# Altium project S7_CAS_lepo3002.PrjPcb (part 1 of 4)
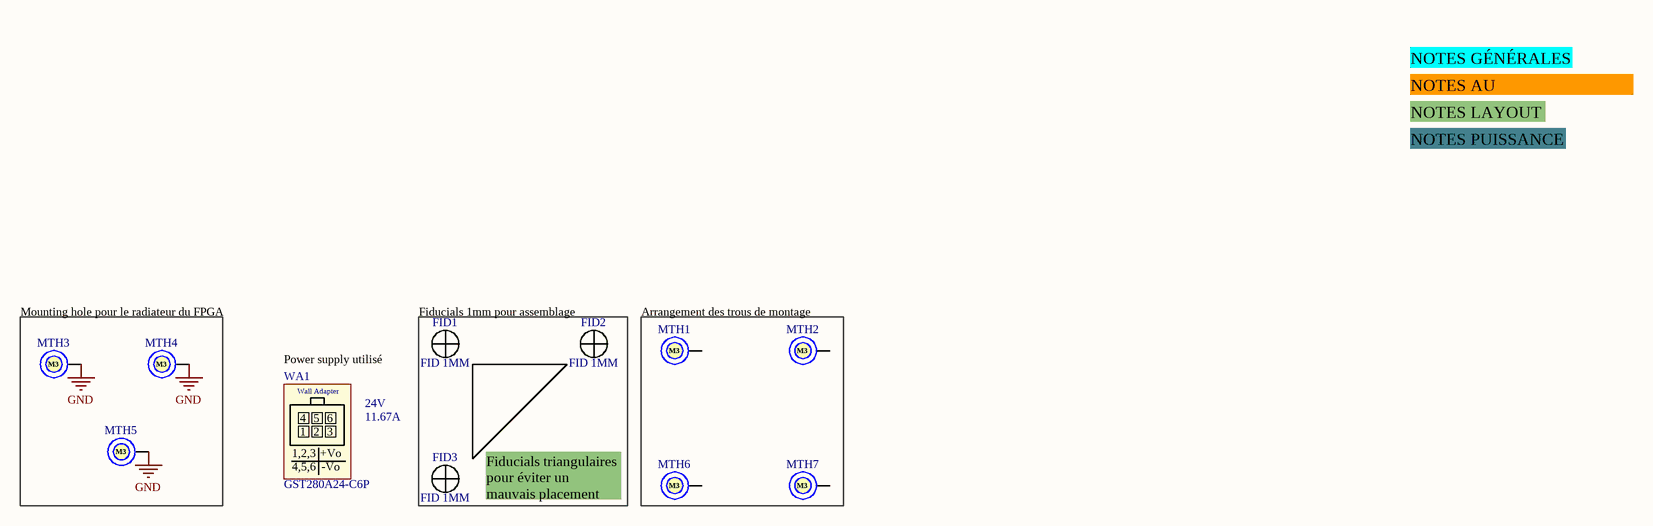
[diagram p0: PROB_S7CAS_Title.SchDoc]
Project_Date: 2023-02-02; Project_Designer1: Samuel Cloutier (clos2312); Project_Designer2: Olivier Lepage (lepo3002); Project_Global: S7_CAS_PROB; Project_Group: clos2312-lepo3002 P11; Project_Name: Pléiades; Project_Revision: 1.00
15 sheets, 468 parts. Net scope: flat (ports and power ports of the same name join across sheets).
Board file: PROB_S7CAS_PCB.PcbDoc
Sheets:
  PROB_S7CAS_Title.SchDoc
  PROB_S7CAS_Connectors.SchDoc
  PROB_S7CAS_ArbreAlimentation.SchDoc
  PROB_S7CAS_BilanPuissance.SchDoc
  PROB_S7CAS_FPGA_1.SchDoc
  PROB_S7CAS_FPGA_2.SchDoc
  PROB_S7CAS_FPGA_3.SchDoc
  PROB_S7CAS_INTERFACE.SchDoc
  PROB_S7CAS_Clock.SchDoc
  PROB_S7CAS_DDR.SchDoc
  PROB_S7CAS_PHY.SchDoc
  PROB_S7CAS_DAC.SchDoc
  PROB_S7CAS_ADC.SchDoc
  PROB_S7CAS_MOTDRIVER.SchDoc
  PROB_S7CAS_FLASH-JTAG.SchDoc

## Sheet PROB_S7CAS_Title.SchDoc
size Tabloid; SheetNumber: 1; SheetTotal: 15; Sheet_Name: Insert name in Document Parameters; Size: 11x17

### Parts
FID1  FID 1MM  [FID_CIRCLE_1MM]
FID2  FID 1MM  [FID_CIRCLE_1MM]
FID3  FID 1MM  [FID_CIRCLE_1MM]
MTH1  M3  [MTH_M3]  (no BOM)
MTH2  M3  [MTH_M3]  (no BOM)
MTH3  M3  [MTH_M3]  (no BOM)
MTH4  M3  [MTH_M3]  (no BOM)
MTH5  M3  [MTH_M3]  (no BOM)
MTH6  M3  [MTH_M3]  (no BOM)
MTH7  M3  [MTH_M3]  (no BOM)
WA1  GST280A24-C6P  value 24V  Current Rating: 11.67A  [Model Name]  (mechanical)

### Nets
GND: MTH3.1 MTH4.1 MTH5.1

Not connected (* = marked no-connect by the designer): FID1 1 2; FID2 1 2; FID3 1 2; MTH1 1; MTH2 1; MTH6 1; MTH7 1

### Notes on the sheet
- LÉGENDE NOTES
- NOTES GÉNÉRALES
- NOTES AU PROGRAMMEUR
- NOTES LAYOUT
- NOTES PUISSANCE
- Mounting hole pour le radiateur du FPGA
- Fiducials 1mm pour assemblage
- Arrangement des trous de montage
- Power supply utilisé
- Fiducials triangulaires pour éviter un mauvais placement
- Revision history
- Package size conversion
- Metric
- 1005
- 1608
- Imperial
- 0402
- 0603
- Revision
- 2012
- 3216
- 0805
- 1206
- 3225
- 6432
- 1210
- 2512
- Date :
- Project Title
- Global Project
- Size
- Group
- Date
- Sheet
- of
- Filename
- Designers
- (in symbol UND_GST280A24-C6P) Wall Adapter; 4; 5; 6; 1; 2; 3; 1,2,3; +Vo; 4,5,6; -Vo

### Library data of the parts
FID1-FID3 = FID_CIRCLE_1MM: FID - FIDUCIAL 1MM CIRCLE DOUBLE-SIDED - 1MM; GRAMS Lib Spec: 2.8; Magnetic Material: NO; Cryo: UNKNOWN; Value: *; Tolerance: *; Voltage Rating: *; Current Rating: *; Power Max: *; HelpURL: https://www.pcb-3d.com/wordpress/wp-content/uploads/ipc-sm-782a_amendment_1_and_2.pdf; CreatedBy/Date: Jonathan Bouchard 2018-07-23; VerifiedBy: Caroline Paulin - 25 juillet 2018; Temperature: *; Package: 1MM CIRCLE; Manufacturer #1: *; Manufacturer #2: *; Note: *; Assembly Type: NONE; Part Number #2: *; Part Number #1: *; Polarized: *; Supplier 1: *; Supplier Part Number 1: *
MTH1-MTH7 = MTH_M3: MTH - MOUNTING HOLE M3 PLATED - M3; GRAMS Lib Spec: 2.8; Magnetic Material: NO; Cryo: UNKNOWN; Value: *; Tolerance: *; Voltage Rating: *; Current Rating: *; Power Max: *; HelpURL: https://littlemachineshop.com/images/gallery/PDF/TapDrillSizes.pdf; CreatedBy/Date: Jonathan Bouchard 2018-07-23; VerifiedBy: Arnaud Samson 23-07-18; Temperature: *; Package: M3; Manufacturer #1: *; Manufacturer #2: *; Note: *; Assembly Type: NONE; Part Number #2: *; Part Number #1: *; Polarized: *; Supplier 1: *; Supplier Part Number 1: *
WA1 = UND_GST280A24-C6P: UND - AC/DC DESKTOP ADAPTER 24V 280W - MEC; Manufacturer #1: MEAN WELL USA Inc.; Tolerance: ±3%; Voltage Rating: 85~264VAC; GRAMS Lib Spec: 2.8; Magnetic Material: Unknown; Polarized: Yes; Power Max: 280W; HelpURL: https://www.meanwell.com/Upload/PDF/GST280A/GST280A-SPEC.PDF; CreatedBy/Date: Caroline Paulin - 5 avril 2019; VerifiedBy: Nicolas V. (2019-07-05); Temperature: -30°C to +70°C; Package: -; Manufacturer #2: *; Note: *; Assembly Type: -; Part Number #2: *; Part Number #1: GST280A24-C6P; Supplier 1: Digi-Key; Supplier Part Number 1: 1866-2122-ND; Cryo: UNKNOWN

## Sheet PROB_S7CAS_Connectors.SchDoc
size Tabloid; SheetNumber: 2; SheetTotal: 15; Sheet_Name: Connectors; Size: 11x17
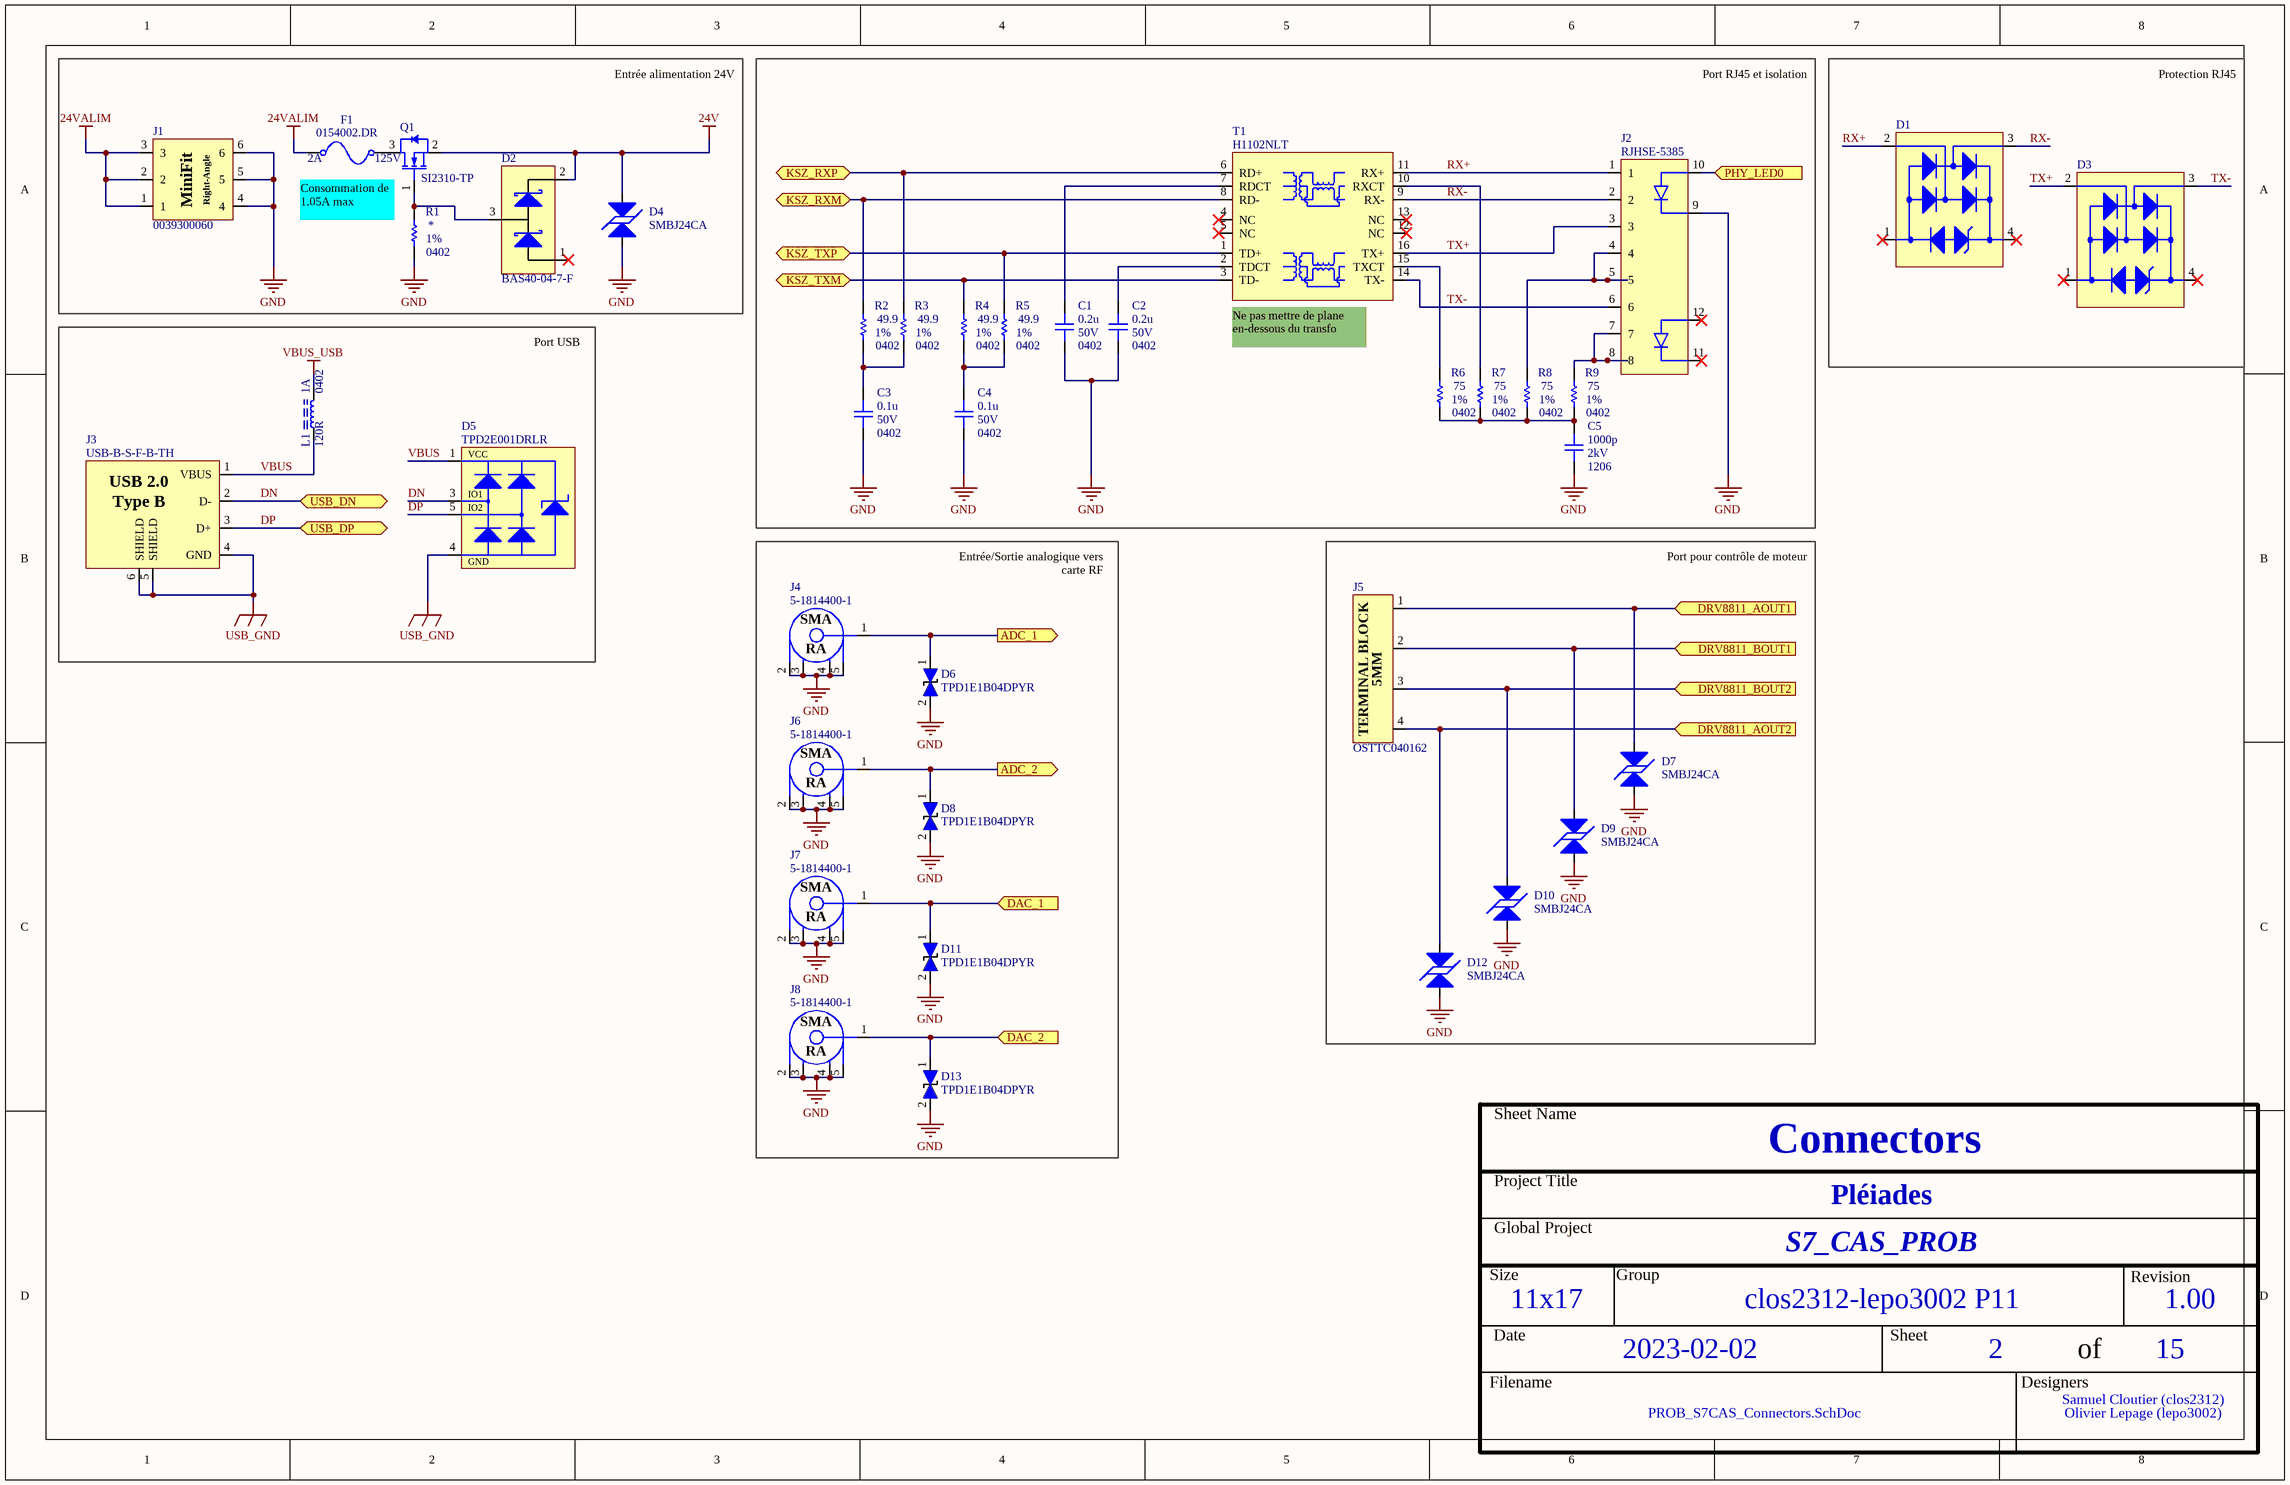
[diagram p1: PROB_S7CAS_Connectors.SchDoc]

### Parts
C1  value 0.2u  Voltage: 50V  Package: 0402  [CAP_0402]  (hidden comment: CAP - 0402)
C2  value 0.2u  Voltage: 50V  Package: 0402  [CAP_0402]  (hidden comment: CAP - 0402)
C3  value 0.1u  Voltage: 50V  Package: 0402  [CAP_0402]  (hidden comment: CAP - 0402)
C4  value 0.1u  Voltage: 50V  Package: 0402  [CAP_0402]  (hidden comment: CAP - 0402)
C5  value 1000p  Voltage: 2kV  Package: 1206  [CAP_0402]  (hidden comment: CAP - 0402)
D1  SR3.3.TCT  [TVS_SR3.3.TCT]  (value not drawn)
D2  BAS40-04-7-F  [DIO_SCHOTTKY_BAS40-04-7-F]
D3  SR3.3.TCT  [TVS_SR3.3.TCT]  (value not drawn)
D4  SMBJ24CA  [TVS_PWR_SMBJ36CA]
D5  TPD2E001DRLR  [TVS_USB_TPD2E001DRLR]
D6  TPD1E1B04DPYR  [TVS_DATA_TPD1E1B04DPYR]
D7  SMBJ24CA  [TVS_PWR_SMBJ36CA]
D8  TPD1E1B04DPYR  [TVS_DATA_TPD1E1B04DPYR]
D9  SMBJ24CA  [TVS_PWR_SMBJ36CA]
D10  SMBJ24CA  [TVS_PWR_SMBJ36CA]
D11  TPD1E1B04DPYR  [TVS_DATA_TPD1E1B04DPYR]
D12  SMBJ24CA  [TVS_PWR_SMBJ36CA]
D13  TPD1E1B04DPYR  [TVS_DATA_TPD1E1B04DPYR]
F1  0154002.DR  Voltage Rating: 125V  Current Rating: 2A  [FUS_0154XXX.DR]
J1  0039300060  [CON_MINIFIT_0039300060]
J2  RJHSE-5385  [CONN_ETHERNET_RJHSE-5385]
J3  USB-B-S-F-B-TH  [CON_USB_USB-B-S-F-B-TH]
J4  5-1814400-1  [CONN_SMA_5-1814400-1]
J5  OSTTC040162  [CONN_TERMINAL_OSTTA040161]
J6  5-1814400-1  [CONN_SMA_5-1814400-1]
J7  5-1814400-1  [CONN_SMA_5-1814400-1]
J8  5-1814400-1  [CONN_SMA_5-1814400-1]
L1  value 120R  Current: 1A  Package: 0402  [FER_0402]  (hidden comment: FER - 0402)
Q1  SI2310-TP  [TRX_NMOS_SI2310-TP]
R1  Package: 0402  Precision: 1%  [RES_0402]  (hidden comment: RES - 0402)
R2  value 49.9  Package: 0402  Precision: 1%  [RES_0402]  (hidden comment: RES - 0402)
R3  value 49.9  Package: 0402  Precision: 1%  [RES_0402]  (hidden comment: RES - 0402)
R4  value 49.9  Package: 0402  Precision: 1%  [RES_0402]  (hidden comment: RES - 0402)
R5  value 49.9  Package: 0402  Precision: 1%  [RES_0402]  (hidden comment: RES - 0402)
R6  value 75  Package: 0402  Precision: 1%  [RES_0402]  (hidden comment: RES - 0402)
R7  value 75  Package: 0402  Precision: 1%  [RES_0402]  (hidden comment: RES - 0402)
R8  value 75  Package: 0402  Precision: 1%  [RES_0402]  (hidden comment: RES - 0402)
R9  value 75  Package: 0402  Precision: 1%  [RES_0402]  (hidden comment: RES - 0402)
T1  H1102NLT  [TRANSFO_H1102NLT]

### Ports
ADC_1 (out), ADC_2 (out), DAC_1 (in), DAC_2 (in), DRV8811_AOUT1 (in), DRV8811_AOUT2 (in), DRV8811_BOUT1 (in), DRV8811_BOUT2 (in), KSZ_RXM (bidir), KSZ_RXP (bidir), KSZ_TXM (bidir), KSZ_TXP (bidir), PHY_LED0 (in), USB_DN (bidir), USB_DP (bidir)

### Nets
24V: D2.2(K) D4.1 Q1.2(S)
24VALIM: F1.1 J1.1 J1.2 J1.3
GND: C1.1 C2.1 C3.1 C4.1 C5.1 D4.2 D6.2(i/o) D7.2 D8.2(i/o) D9.2 D10.2 D11.2(i/o) D12.2 D13.2(i/o) J1.4 J1.5 J1.6 J2.9(LED1_K) J4.2 J4.3 J4.4 J4.5 J6.2 J6.3 J6.4 J6.5 J7.2 J7.3 J7.4 J7.5 J8.2 J8.3 J8.4 J8.5 R1.1
USB_GND: D5.4(GND) J3.4(GND) J3.5(SHIELD) J3.6(SHIELD)
VBUS_USB: L1.1
ADC_1: D6.1(i/o) J4.1 ; port ADC_1
ADC_2: D8.1(i/o) J6.1 ; port ADC_2
DAC_1: D11.1(i/o) J7.1 ; port DAC_1
DAC_2: D13.1(i/o) J8.1 ; port DAC_2
DN: D5.3(IO1) J3.2(D-) ; port USB_DN
DP: D5.5(IO2) J3.3(D+) ; port USB_DP
DRV8811_AOUT1: D7.1 J5.1 ; port DRV8811_AOUT1
DRV8811_AOUT2: D12.1 J5.4 ; port DRV8811_AOUT2
DRV8811_BOUT1: D9.1 J5.2 ; port DRV8811_BOUT1
DRV8811_BOUT2: D10.1 J5.3 ; port DRV8811_BOUT2
KSZ_RXM: R2.2 T1.8(RD-) ; port KSZ_RXM
KSZ_RXP: R3.2 T1.6(RD+) ; port KSZ_RXP
KSZ_TXM: R4.2 T1.3(TD-) ; port KSZ_TXM
KSZ_TXP: R5.2 T1.1(TD+) ; port KSZ_TXP
PHY_LED0: J2.10(LED1_A) ; port PHY_LED0
RX+: D1.2(VN) J2.1 T1.11(RX+)
RX-: D1.3 J2.2 T1.9(RX-)
TX+: D3.2(VN) J2.3 T1.16(TX+)
TX-: D3.3 J2.6 T1.14(TX-)
VBUS: D5.1(VCC) J3.1(VBUS) L1.2
NetC1_2: C1.2 T1.7(RDCT)
NetC2_2: C2.2 T1.2(TDCT)
NetC3_2: C3.2 R2.1 R3.1
NetC4_2: C4.2 R4.1 R5.1
NetC5_2: C5.2 R6.1 R7.1 R8.1 R9.1
NetD2_3: D2.3(AK) Q1.1(G) R1.2
NetF1_2: F1.2 Q1.3(D)
NetJ2_4: J2.4 J2.5 R8.2
NetJ2_7: J2.7 J2.8 R9.2
NetR6_2: R6.2 T1.15(TXCT)
NetR7_2: R7.2 T1.10(RXCT)

Not connected (* = marked no-connect by the designer): D1 1(I/O)* 4*; D2 1(A)*; D3 1(I/O)* 4*; D5 2(NC); J2 11(LED2_K)* 12(LED2_A)*; T1 4(NC)* 5(NC)* 12(NC)* 13(NC)*

### Notes on the sheet
- Entrée alimentation 24V
- Port RJ45 et isolation
- Protection RJ45
- (near Q1) Consommation de 1.05A max
- Port USB
- (near T1) Ne pas mettre de plane en-dessous du transfo
- Entrée/Sortie analogique vers carte RF
- Port pour contrôle de moteur
- Sheet Name
- Project Title
- Global Project
- Size
- Group
- Revision
- Date
- Sheet
- of
- Filename
- Designers
- (in symbol CON_MINIFIT_0039300060) MiniFit; Right-Angle
- (in symbol CON_USB_USB-B-S-F-B-TH) USB 2.0; Type B
- (in symbol CONN_SMA_5-1814400-1) SMA; RA
- (in symbol CONN_TERMINAL_OSTTC040162) TERMINAL BLOCK; 5MM

### Library data of the parts
C1-C5 = CAP - 0402: Precision: 10%; Current: *; CreatedBy: Jonathan Bouchard; Power: *
D1 D3 = TVS_SR3.3.TCT: TVS - DIODE ARRAY 3.3V 150W - SOT143-4; Mfg: Semtech; Voltage: VBR=3.3V; Current: *; Mfg Part Number: SR3.3.TCT; HelpURL: http://www.semtech.com/images/datasheet/sr3.3.pdf; CreatedBy: Jonathan Bouchard; Temperature: -55°C to 125°C; Power: 150W; Package: SOT143-4; Precision: *; Value: *; Supplier 1: Digikey; Supplier Part Number 1: SR3.3DKR-ND
D2 = DIO_SCHOTTKY_BAS40-04-7-F: DIO - Schottky Array 1 Pair Series Connection - SOT-23-3; Manufacturer #1: Diodes Incorporated; Voltage Rating: 40V dc reverse; Current Rating: 200mA; GRAMS Lib Spec: 2.8; Magnetic Material: Unknown; Polarized: Yes; Value: -; Tolerance: -; Power Max: -; HelpURL: https://www.diodes.com/assets/Datasheets/ds11006.pdf; CreatedBy/Date: Danae D-F 15 août 2019; VerifiedBy: C.Paulin - 16/08/2019; Temperature: -55°C ~ 125°C; Package: SOT-23-3; Manufacturer #2: -; Assembly Type: SMD; Part Number #2: -; Part Number #1: BAS40-04-7-F; Supplier 1: Digi-Key; Supplier Part Number 1: BAS40-04FDITR-ND; Cryo: UNKNOWN
D4 D7 D9 D10 D12 = TVS_PWR_SMBJ24CA: TVS - 24V 26.7V 600W - DO214AA; Manufacturer #1: Littelfuse Inc.; Value: Vbr = 26.7V -  Clamp = 38.9V; Voltage Rating: 24V Standoff; Current Rating: 15.5A; GRAMS Lib Spec: 2.8; Magnetic Material: UNKNOWN; Polarized: NO; Tolerance: *; Power Max: 600W; HelpURL: http://www.littelfuse.com/~/media/electronics/datasheets/tvs_diodes/littelfuse_tvs_diode_smbj_datasheet.pdf.pdf; CreatedBy/Date: Arnaud Samson - 06/07/18; VerifiedBy: Jonathan Bouchard - 2018-07-13; Temperature: -65°C ~ 150°C (TJ); Package: DO214AA; Manufacturer #2: *; Note: *; Assembly Type: SMD; Part Number #2: *; Part Number #1: SMBJ24CA; Supplier 1: Digi-Key; Supplier Part Number 1: SMBJ24CALFCT-ND; Cryo: UNKNOWN
D5 = TVS_USB_TPD2E001DRLR: TVS - USB TVS DIODE 5.5V - SOT-553; Manufacturer #1: Texas Instruments; Value: 11V Breakdown; Voltage Rating: 5.5V (Max); GRAMS Lib Spec: 2.8; Magnetic Material: YES; Cryo: UNKNOWN; Tolerance: *; Current Rating: *; Power Max: *; HelpURL: http://www.ti.com/lit/ds/symlink/tpd2e001.pdf; CreatedBy/Date: Jonathan Bouchard 2018-07-10; VerifiedBy: Arnaud Samson 16-07-18; Temperature: -40°C ~ 85°C (TA); Package: SOT-553; Manufacturer #2: *; Note: *; Assembly Type: SMD; Part Number #2: *; Part Number #1: TPD2E001DRLR; Polarized: YES; Supplier 1: Digi-Key; Supplier Part Number 1: 296-21883-1-ND
D6 D8 D11 D13 = TVS_DATA_TPD1E1B04DPYR: TVS - TVS DIODE 3.6V 8.5V - 0402; Manufacturer #1: Texas Instruments; Current Rating: 6.3Apeak; Power Max: 50Wpeak; GRAMS Lib Spec: 2.8; Magnetic Material: Unknown; Polarized: No; Value: *; Tolerance: *; Voltage Rating: 3.6V; HelpURL: http://www.ti.com/lit/ds/symlink/tpd1e1b04.pdf; CreatedBy/Date: Keven Deslandes - 2018/10/19; VerifiedBy: Caroline Paulin - 28 janv 2019; Temperature: -40°C ~ 125°C (TA); Package: 0402; Manufacturer #2: *; Note: *; Assembly Type: SMD; Part Number #2: *; Part Number #1: TPD1E1B04DPYR; Supplier 1: Digi-Key; Supplier Part Number 1: 296-47364-1-ND; Cryo: UNKNOWN
F1 = FUS_0154002.DR: FUS - 2 A 125 VAC/VDC - 2-SMD; Manufacturer #1: Littelfuse Inc.; Value: 2A 125V AC/DC FAST; GRAMS Lib Spec: 2.8; Magnetic Material: UNKNOWN; Polarized: NO; Tolerance: *; Power Max: *; HelpURL: http://www.littelfuse.com/~/media/electronics/datasheets/fuses/littelfuse_fuse_154_154t_154l_154tl_datasheet.pdf.pdf; CreatedBy/Date: Jonathan Bouchard 2018-07-17; VerifiedBy: Arnaud Samson 23-07-18; Temperature: -55°C ~ 125°C; Package: 2-SMD; Manufacturer #2: *; Note: *; Assembly Type: SMD; Part Number #2: *; Part Number #1: 0154002.DR; Supplier 1: Digi-Key; Supplier Part Number 1: F1224CT-ND; Cryo: UNKNOWN
J1 = CON_MINIFIT_0039300060: CON - Mini-Fit Through Hole, Right Angle 6 position; Manufacturer #1: Molex; Current Rating: 8A; GRAMS Lib Spec: 2.8; Magnetic Material: Unknown; Polarized: Yes; Voltage Rating: 600V; Assembly Type: TH; CreatedBy/Date: Joel Lemay 2018-06-21; HelpURL: https://www.molex.com/pdm_docs/sd/039300060_sd.pdf; Manufacturer #2: *; Package: TH; Part Number #1: 0039300060; Part Number #2: *; Power Max: *; Supplier 1: Digi-Key; Supplier Part Number 1: WM21353-ND; Temperature: - 40°C to + 80°C; Tolerance: *; Value: *; VerifiedBy: Caroline Paulin - 10 sept 2018; Cryo: UNKNOWN
J2 = CONN_ETHERNET_RJHSE-5385: CONN - MOD JACK RJ45 R/A ETHERNET - TH; Mfg: Amphenol; Voltage: *; Current: *; Power: *; Mfg Part Number: RJHSE-5385; HelpURL: https://www.amphenolcanada.com/ProductSearch/drawings/AC/RJHSE538X.pdf; CreatedBy: Jonathan Bouchard; Temperature: -55°C ~ 85°C; Value: *; Precision: *; Package: TH-12; Supplier 1: Digikey; Supplier Part Number 1: RJHSE-5385-ND
J3 = CON_USB_USB-B-S-F-B-TH: CON - USB B RECPT TH R/A - 4-TH; Manufacturer #1: Samtec Inc.; Value: USB B; Voltage Rating: 30VAC; GRAMS Lib Spec: 2.8c; Magnetic Material: UNKNOWN; Polarized: YES; Tolerance: *; Current Rating: *; Power Max: *; HelpURL: http://suddendocs.samtec.com/catalog_english/usb_b.pdf; CreatedBy/Date: Jonathan Bouchard 2020-03-24; VerifiedBy: C.Paulin - 22/04/2020; Temperature: -50°C ~ 85°C; Package: 4-TH; Manufacturer #2: *; Note: *; Assembly Type: TH; Part Number #2: *; Part Number #1: USB-B-S-F-B-TH; Supplier 1: Digi-Key; Supplier Part Number 1: SAM10867-ND; Cryo: UNKNOWN
J4 J6-J8 = CONN_SMA_5-1814400-1: CONN -  SMA JACK R/A 50 OHM - TH; Mfg: TE Connectivity AMP Connectors; Voltage: *; Current: *; Power: *; Mfg Part Number: 5-1814400-1; HelpURL: http://www.te.com/commerce/DocumentDelivery/DDEController?Action=srchrtrv&DocNm=1814400&DocType=Customer+Drawing&DocLang=English; CreatedBy: Jonathan Bouchard; Temperature: -55°C ~ 85°C; Value: *; Precision: *; Package: TH-5; Supplier 1: Digikey; Supplier Part Number 1: A97593-ND
J5 = CONN_TERMINAL_OSTTC040162: CONN -  TERMINAL BLOCK 4POS 5MM - TH; Mfg: On Shore Technology Inc.; Voltage: *; Current: *; Power: *; Mfg Part Number: OSTTC040162; HelpURL: http://www.on-shore.com/wp-content/uploads/2015/09/osttcxx0162.pdf; CreatedBy: Jonathan Bouchard; Temperature: -30°C ~ 105°C; Value: *; Precision: *; Package: TH-4; Supplier 1: Digikey; Supplier Part Number 1: ED2602-ND
Q1 = TRX_NMOS_SI2310-TP: TRX - MOSFET N-CH 60V 3A - SOT-23; Manufacturer #1: Micro Commercial Co; Power Max: 350mW; Voltage rating: 60V (Vds max), 2V (Vgs @ 250uA); Polarized: Yes; Magnetic Material: UNKNOWN; GRAMS Lib Spec: 2.8c; Current Rating: 3A; Manufacturer #2: *; Value: *; Part Number #1: SI2310-TP; Part Number #2: *; HelpURL: https://www.mccsemi.com/pdf/Products/SI2310(SOT-23)-A.pdf; Supplier 1: Digi-Key; Supplier Part Number 1: SI2310-TPMSCT-ND; Assembly Type: SMD; Temperature: -55°C ~ 150°C (TJ); Package: SOT-23; CreatedBy/Date: Louis-Daniel Gaulin / 20-02-2020; Tolerance: *; VerifiedBy: C.Paulin - 21/02/2020; Cryo: UNKNOWN
R1-R9 = RES - 0402: Voltage: 50V; Power: 1/16W; Current: *; CreatedBy: Jonathan Bouchard
  R1: Value: *
T1 = TRANSFO_H1102NLT: TRANSFO - ETHERNET 10/100B-TX - SMD-16; Mfg: Pulse Eng.; Value: 1:1 (350uH); Voltage: *; Current: *; Power: *; Mfg Part Number: H1102NLT; HelpURL: http://media.digikey.com/pdf/Data%20Sheets/Pulse%20PDFs/10_100BASE-T%20Single%20Port%20SMD%20Magnetics_Rev2008.pdf; CreatedBy: Jonathan Bouchard; Temperature: -40°C to 85°C; Precision: *; Package: SMD-16; Supplier 1: Digikey; Supplier Part Number 1: 553-1532-1-ND
L1 = FER - 0402: Voltage: *; CreatedBy: Jonathan Bouchard; Power: *; Precision: *

## Sheet PROB_S7CAS_ArbreAlimentation.SchDoc
size Tabloid; SheetNumber: 3; SheetTotal: 15; Sheet_Name: Arbre d'alimentation; Size: 11x17
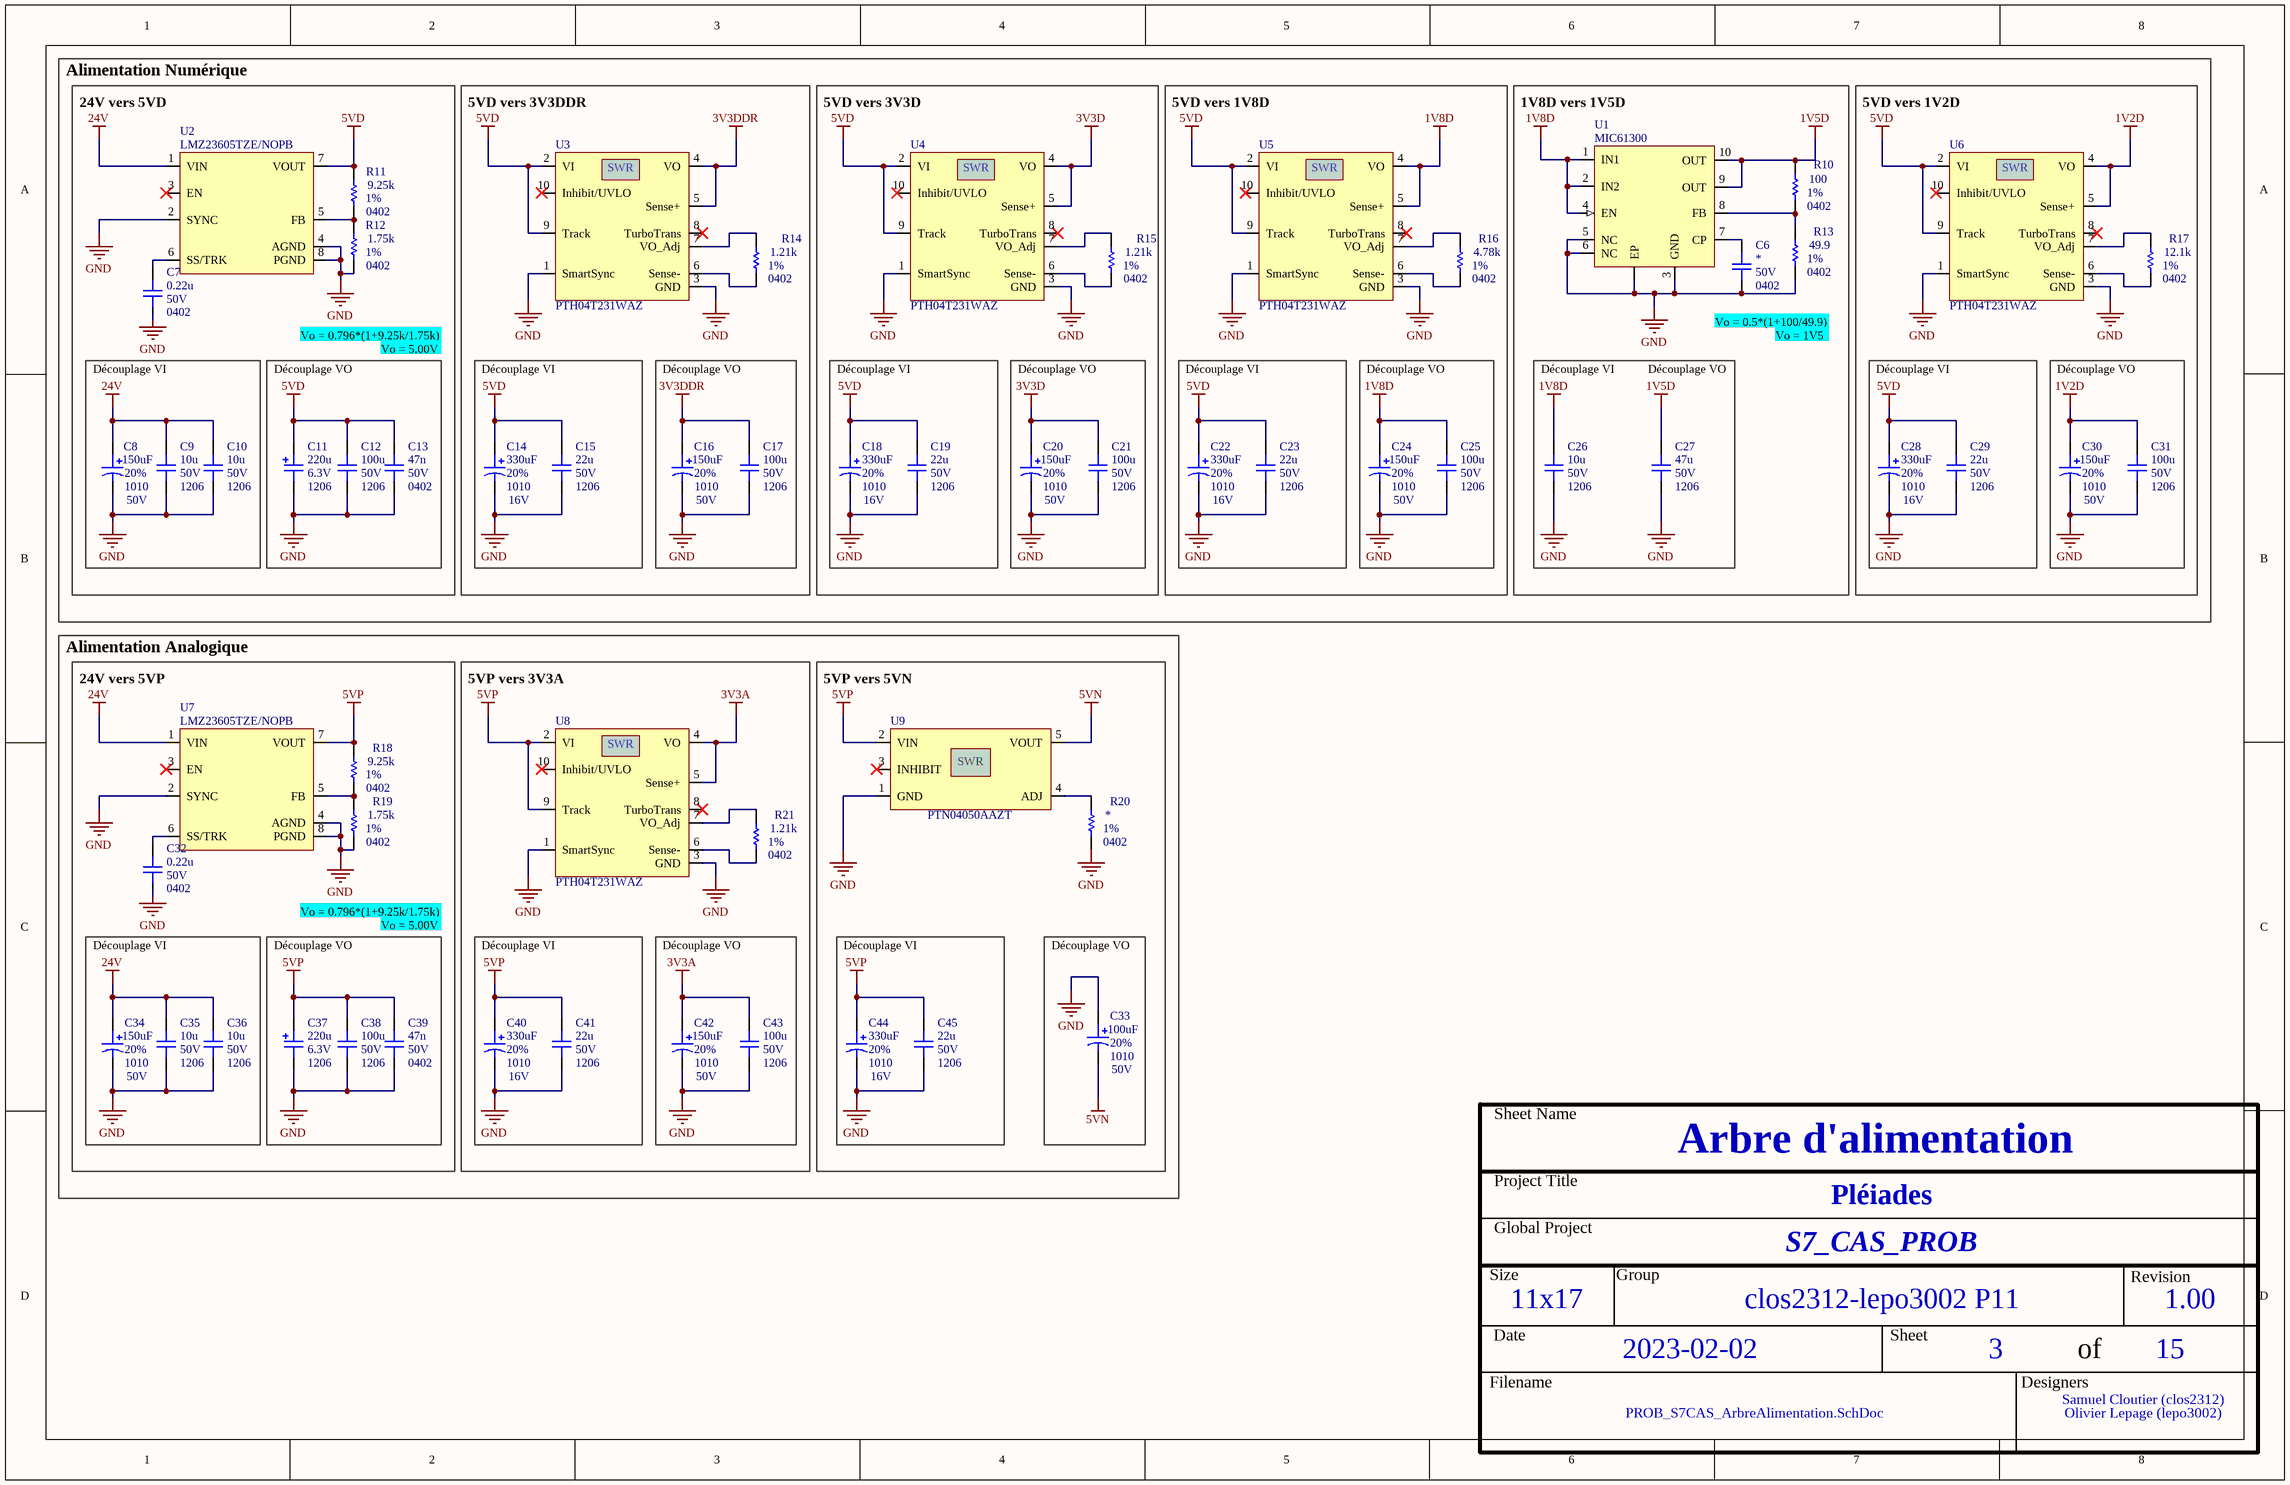
[diagram p2: PROB_S7CAS_ArbreAlimentation.SchDoc]

### Parts
C6  Voltage: 50V  Package: 0402  [CAP_0402]  (hidden comment: CAP - 0402)
C7  value 0.22u  Voltage: 50V  Package: 0402  [CAP_0402]  (hidden comment: CAP - 0402)
C8  value 150uF  Voltage: 50V  Package: 1010  Precision: 20%  [CAP_ALU_1010_vishay]  (hidden comment: MAL215099101E3)
C9  value 10u  Voltage: 50V  Package: 1206  [CAP_1206]  (hidden comment: CAP - 1206)
C10  value 10u  Voltage: 50V  Package: 1206  [CAP_1206]  (hidden comment: CAP - 1206)
C11  value 220u  Voltage: 6.3V  Package: 1206  [CAP_TAN_1206(A)]  (hidden comment: CAP - TANTALUM - CASE A)
C12  value 100u  Voltage: 50V  Package: 1206  [CAP_1206]  (hidden comment: CAP - 1206)
C13  value 47n  Voltage: 50V  Package: 0402  [CAP_0402]  (hidden comment: CAP - 0402)
C14  value 330uF  Voltage: 16V  Package: 1010  Precision: 20%  [CAP_ALU_1010_vishay]  (hidden comment: MAL214699501E3)
C15  value 22u  Voltage: 50V  Package: 1206  [CAP_1206]  (hidden comment: CAP - 1206)
C16  value 150uF  Voltage: 50V  Package: 1010  Precision: 20%  [CAP_ALU_1010_vishay]  (hidden comment: MAL215099101E3)
C17  value 100u  Voltage: 50V  Package: 1206  [CAP_1206]  (hidden comment: CAP - 1206)
C18  value 330uF  Voltage: 16V  Package: 1010  Precision: 20%  [CAP_ALU_1010_vishay]  (hidden comment: MAL214699501E3)
C19  value 22u  Voltage: 50V  Package: 1206  [CAP_1206]  (hidden comment: CAP - 1206)
C20  value 150uF  Voltage: 50V  Package: 1010  Precision: 20%  [CAP_ALU_1010_vishay]  (hidden comment: MAL215099101E3)
C21  value 100u  Voltage: 50V  Package: 1206  [CAP_1206]  (hidden comment: CAP - 1206)
C22  value 330uF  Voltage: 16V  Package: 1010  Precision: 20%  [CAP_ALU_1010_vishay]  (hidden comment: MAL214699501E3)
C23  value 22u  Voltage: 50V  Package: 1206  [CAP_1206]  (hidden comment: CAP - 1206)
C24  value 150uF  Voltage: 50V  Package: 1010  Precision: 20%  [CAP_ALU_1010_vishay]  (hidden comment: MAL215099101E3)
C25  value 100u  Voltage: 50V  Package: 1206  [CAP_1206]  (hidden comment: CAP - 1206)
C26  value 10u  Voltage: 50V  Package: 1206  [CAP_1206]  (hidden comment: CAP - 1206)
C27  value 47u  Voltage: 50V  Package: 1206  [CAP_1206]  (hidden comment: CAP - 1206)
C28  value 330uF  Voltage: 16V  Package: 1010  Precision: 20%  [CAP_ALU_1010_vishay]  (hidden comment: MAL214699501E3)
C29  value 22u  Voltage: 50V  Package: 1206  [CAP_1206]  (hidden comment: CAP - 1206)
C30  value 150uF  Voltage: 50V  Package: 1010  Precision: 20%  [CAP_ALU_1010_vishay]  (hidden comment: MAL215099101E3)
C31  value 100u  Voltage: 50V  Package: 1206  [CAP_1206]  (hidden comment: CAP - 1206)
C32  value 0.22u  Voltage: 50V  Package: 0402  [CAP_0402]  (hidden comment: CAP - 0402)
C33  value 100uF  Voltage: 50V  Package: 1010  Precision: 20%  [CAP_ALU_1010_vishay]  (hidden comment: MAL215099101E3)
C34  value 150uF  Voltage: 50V  Package: 1010  Precision: 20%  [CAP_ALU_1010_vishay]  (hidden comment: MAL215099101E3)
C35  value 10u  Voltage: 50V  Package: 1206  [CAP_1206]  (hidden comment: CAP - 1206)
C36  value 10u  Voltage: 50V  Package: 1206  [CAP_1206]  (hidden comment: CAP - 1206)
C37  value 220u  Voltage: 6.3V  Package: 1206  [CAP_TAN_1206(A)]  (hidden comment: CAP - TANTALUM - CASE A)
C38  value 100u  Voltage: 50V  Package: 1206  [CAP_1206]  (hidden comment: CAP - 1206)
C39  value 47n  Voltage: 50V  Package: 0402  [CAP_0402]  (hidden comment: CAP - 0402)
C40  value 330uF  Voltage: 16V  Package: 1010  Precision: 20%  [CAP_ALU_1010_vishay]  (hidden comment: MAL214699501E3)
C41  value 22u  Voltage: 50V  Package: 1206  [CAP_1206]  (hidden comment: CAP - 1206)
C42  value 150uF  Voltage: 50V  Package: 1010  Precision: 20%  [CAP_ALU_1010_vishay]  (hidden comment: MAL215099101E3)
C43  value 100u  Voltage: 50V  Package: 1206  [CAP_1206]  (hidden comment: CAP - 1206)
C44  value 330uF  Voltage: 16V  Package: 1010  Precision: 20%  [CAP_ALU_1010_vishay]  (hidden comment: MAL214699501E3)
C45  value 22u  Voltage: 50V  Package: 1206  [CAP_1206]  (hidden comment: CAP - 1206)
R10  value 100  Package: 0402  Precision: 1%  [RES_0402]  (hidden comment: RES - 0402)
R11  value 9.25k  Package: 0402  Precision: 1%  [RES_0402]  (hidden comment: RES - 0402)
R12  value 1.75k  Package: 0402  Precision: 1%  [RES_0402]  (hidden comment: RES - 0402)
R13  value 49.9  Package: 0402  Precision: 1%  [RES_0402]  (hidden comment: RES - 0402)
R14  value 1.21k  Package: 0402  Precision: 1%  [RES_0402]  (hidden comment: RES - 0402)
R15  value 1.21k  Package: 0402  Precision: 1%  [RES_0402]  (hidden comment: RES - 0402)
R16  value 4.78k  Package: 0402  Precision: 1%  [RES_0402]  (hidden comment: RES - 0402)
R17  value 12.1k  Package: 0402  Precision: 1%  [RES_0402]  (hidden comment: RES - 0402)
R18  value 9.25k  Package: 0402  Precision: 1%  [RES_0402]  (hidden comment: RES - 0402)
R19  value 1.75k  Package: 0402  Precision: 1%  [RES_0402]  (hidden comment: RES - 0402)
R20  Package: 0402  Precision: 1%  [RES_0402]  (hidden comment: RES - 0402)
R21  value 1.21k  Package: 0402  Precision: 1%  [RES_0402]  (hidden comment: RES - 0402)
U1  MIC61300  [TSSOP50P490X104-10N]
U2  LMZ23605TZE/NOPB  [REG_SWR_LMZ23605TZE/NOPB]
U3  PTH04T231WAZ  [REG_SWR_PTH04T231WAZ]
U4  PTH04T231WAZ  [REG_SWR_PTH04T231WAZ]
U5  PTH04T231WAZ  [REG_SWR_PTH04T231WAZ]
U6  PTH04T231WAZ  [REG_SWR_PTH04T231WAZ]
U7  LMZ23605TZE/NOPB  [REG_SWR_LMZ23605TZE/NOPB]
U8  PTH04T231WAZ  [REG_SWR_PTH04T231WAZ]
U9  PTN04050AAZT  [REG_SWR_PTN04050AAZT]

### Nets
1V2D: C30.1 C31.2 U6.4(VO) U6.5(Sense+)
1V5D: C27.2 R10.2 U1.9(OUT) U1.10(OUT)
1V8D: C24.1 C25.2 C26.2 U1.1(IN1) U1.2(IN2) U1.4(EN) U5.4(VO) U5.5(Sense+)
3V3A: C42.1 C43.2 U8.4(VO) U8.5(Sense+)
3V3D: C20.1 C21.2 U4.4(VO) U4.5(Sense+)
3V3DDR: C16.1 C17.2 U3.4(VO) U3.5(Sense+)
5VD: C11.2 C12.2 C13.2 C14.1 C15.2 C18.1 C19.2 C22.1 C23.2 C28.1 C29.2 R11.2 U2.7(VOUT) U3.2(VI) U3.9(Track) U4.2(VI) U4.9(Track) U5.2(VI) U5.9(Track) U6.2(VI) U6.9(Track)
5VN: C33.2 U9.5(VOUT)
5VP: C37.2 C38.2 C39.2 C40.1 C41.2 C44.1 C45.2 R18.2 U7.7(VOUT) U8.2(VI) U8.9(Track) U9.2(VIN)
24V: C8.1 C9.2 C10.2 C34.1 C35.2 C36.2 U2.1(VIN) U7.1(VIN)
GND: C6.1 C7.1 C8.2 C9.1 C10.1 C11.1 C12.1 C13.1 C14.2 C15.1 C16.2 C17.1 C18.2 C19.1 C20.2 C21.1 C22.2 C23.1 C24.2 C25.1 C26.1 C27.1 C28.2 C29.1 C30.2 C31.1 C32.1 C33.1 C34.2 C35.1 C36.1 C37.1 C38.1 C39.1 C40.2 C41.1 C42.2 C43.1 C44.2 C45.1 R12.1 R13.1 R19.1 R20.1 U1.3(GND) U1.5(NC) U1.6(NC) U1.?1(EP) U2.2(SYNC) U2.4(AGND) U2.8(PGND) U3.1(SmartSync) U3.3(GND) U4.1(SmartSync) U4.3(GND) U5.1(SmartSync) U5.3(GND) U6.1(SmartSync) U6.3(GND) U7.2(SYNC) U7.4(AGND) U7.8(PGND) U8.1(SmartSync) U8.3(GND) U9.1(GND)
NetC6_2: C6.2 U1.7(CP)
NetC7_2: C7.2 U2.6(SS/TRK)
NetC32_2: C32.2 U7.6(SS/TRK)
NetR10_1: R10.1 R13.2 U1.8(FB)
NetR11_1: R11.1 R12.2 U2.5(FB)
NetR14_1: R14.1 U3.6(Sense-)
NetR14_2: R14.2 U3.7(VO_Adj)
NetR15_1: R15.1 U4.6(Sense-)
NetR15_2: R15.2 U4.7(VO_Adj)
NetR16_1: R16.1 U5.6(Sense-)
NetR16_2: R16.2 U5.7(VO_Adj)
NetR17_1: R17.1 U6.6(Sense-)
NetR17_2: R17.2 U6.7(VO_Adj)
NetR18_1: R18.1 R19.2 U7.5(FB)
NetR20_2: R20.2 U9.4(ADJ)
NetR21_1: R21.1 U8.6(Sense-)
NetR21_2: R21.2 U8.7(VO_Adj)

Not connected (* = marked no-connect by the designer): U2 3(EN)*; U3 8(TurboTrans)* 10(Inhibit/UVLO)*; U4 8(TurboTrans)* 10(Inhibit/UVLO)*; U5 8(TurboTrans)* 10(Inhibit/UVLO)*; U6 8(TurboTrans)* 10(Inhibit/UVLO)*; U7 3(EN)*; U8 8(TurboTrans)* 10(Inhibit/UVLO)*; U9 3(INHIBIT)*

### Notes on the sheet
- Alimentation Numérique
- (near U2) 24V vers 5VD
- (near U3) 5VD vers 3V3DDR
- (near U4) 5VD vers 3V3D
- (near U5) 5VD vers 1V8D
- (near U1) 1V8D vers 1V5D
- (near U6) 5VD vers 1V2D
- Vo = 0.796*(1+9.25k/1.75k)
- Vo = 5.00V
- Vo = 0.5*(1+100/49.9)
- Vo = 1V5
- Découplage VI
- Découplage VO
- Alimentation Analogique
- (near U7) 24V vers 5VP
- (near U8) 5VP vers 3V3A
- (near U9) 5VP vers 5VN
- Sheet Name
- Project Title
- Global Project
- Size
- Group
- Revision
- Date
- Sheet
- of
- Filename
- Designers
- (in symbol REG_SWR_PTH04T231WAZ) SWR
- (in symbol REG_SWR_PTN04050AAZT) SWR

### Library data of the parts
C6 C7 C13 C32 C39 = CAP - 0402: Precision: 10%; Current: *; CreatedBy: Jonathan Bouchard; Power: *
  C6: Value: *
C8 C16 C20 C24 C30 C33 C34 C42 = CAP_ALU_MAL215099101E3: CAP - ALU 100uF 20% 50V - 1010; Current: 490mA; Mfg: Vishay Dale; Mfg Part Number: MAL215099101E3; HelpURL: http://www.vishay.com/docs/28395/150crz.pdf; CreatedBy: Jonathan Bouchard; Temperature: -55°C to 125°C; Power: *; Supplier 1: Digikey; Supplier Part Number 1: 4399PHDKR-ND
C9 C10 C12 C15 C17 C19 C21 C23 C25-C27 C29 C31 C35 C36 C38 C41 C43 C45 = CAP - 1206: Precision: 10%; Current: *; CreatedBy: Jonathan Bouchard; Power: *
C11 C37 = CAP_TANT_1206(A): CAP - TANTALUM - 1206; Precision: 10%; Current: *; CreatedBy: Jonathan Bouchard; Power: *
C14 C18 C22 C28 C40 C44 = CAP_ALU_MAL214699501E3: CAP - ALU 330uF 20% 16V - 1010; Current: 750mA; Mfg: Vishay Dale; Mfg Part Number: MAL214699501E3; HelpURL: http://www.vishay.com/docs/28403/146cti.pdf; CreatedBy: Jonathan Bouchard; Temperature: -55°C to 125°C; Power: *; Supplier 1: Digikey; Supplier Part Number 1: 4405PHCT-ND
R10-R21 = RES - 0402: Voltage: 50V; Power: 1/16W; Current: *; CreatedBy: Jonathan Bouchard
  R20: Value: *
U1 = MIC61300: MIC61300 - Low Input Voltage, Single-Supply / High-Current LDO - MSOP; GRAMS Lib Spec: 2.7; HelpURL: https://ww1.microchip.com/downloads/en/DeviceDoc/mic61300.pdf
U2 U7 = REG_SWR_LMZ23605TZE/NOPB: REG - IC BUCK SYNC 36V 5A - TO-PMOD-7; Manufacturer #1: Texas Instruments; Value: 0.8 ~ 6 V; Voltage Rating: 6 ~ 36 V; GRAMS Lib Spec: 2.8; Note: One Reflow; Magnetic Material: YES; Cryo: UNKNOWN; Tolerance: *; Current Rating: 5A; Power Max: *; HelpURL: http://www.ti.com/lit/ds/symlink/lmz23605.pdf; CreatedBy/Date: Arnaud Samson - 05/07/18; VerifiedBy: Jonathan Bouchard 2018-07-13; Temperature: -40°C ~ 125°C; Package: TO-PMOD-7; Manufacturer #2: *; Assembly Type: SMD; Part Number #2: *; Part Number #1: LMZ23605TZE/NOPB; Polarized: YES; Supplier 1: Digi-Key; Supplier Part Number 1: 296-35357-1-ND
U3-U6 U8 = REG_SWR_PTH04T231WAZ: REG - MODULE PIP 6A 2.2V/5.5V - 10SMD; Manufacturer #1: Texas Instruments; Current Rating: 6A (out); Value: 0.69 - 3.6V (Out); Voltage rating: 2.2-5.5V (Input); Polarized: Yes; Magnetic Material: UNKNOWN; Manufacturer #2: *; Note: *; Power Max: *; Part Number #1: PTH04T231WAZ; Part Number #2: *; HelpURL: http://www.ti.com/lit/ds/symlink/pth04t231w.pdf; Supplier 1: Digi-Key; Assembly Type: SMD; Temperature: -40°C ~ 85°C; Supplier Part Number 1: 296-21792-ND; Package: SMD; CreatedBy/Date: Olivier Bernard / 6/5/2018; VerifiedBy: Caroline Paulin / 10 juillet 2018; Cryo: UNKNOWN
U9 = REG_SWR_PTN04050AAZT: REG - SWR -15 ~ -3.3V 1A 6W - 5-SMD; Manufacturer #1: Texas Instruments; Voltage Rating: 2.9V~7Vin; GRAMS Lib Spec: 2.8; Magnetic Material: Unknown; Polarized: Yes; Value: -15 ~ -3.3V; Tolerance: *; Current Rating: 1A; Power Max: 6W; HelpURL: http://www.ti.com/lit/ds/symlink/ptn04050a.pdf; CreatedBy/Date: Ihsane Najahi 2019-09-25; VerifiedBy: C.Paulin (9-10-2019); Temperature: -40°C ~ 85°C; Package: 5-SMD; Manufacturer #2: *; Note: *; Assembly Type: 5-SMD; Part Number #2: *; Part Number #1: PTN04050AAZT; Supplier 1: Digi-Key; Supplier Part Number 1: 296-32208-1-ND; Cryo: UNKNOWN

## Sheet PROB_S7CAS_BilanPuissance.SchDoc
size Tabloid; SheetNumber: 4; SheetTotal: 15; Sheet_Name: Bilan de puissance; Size: 11x17
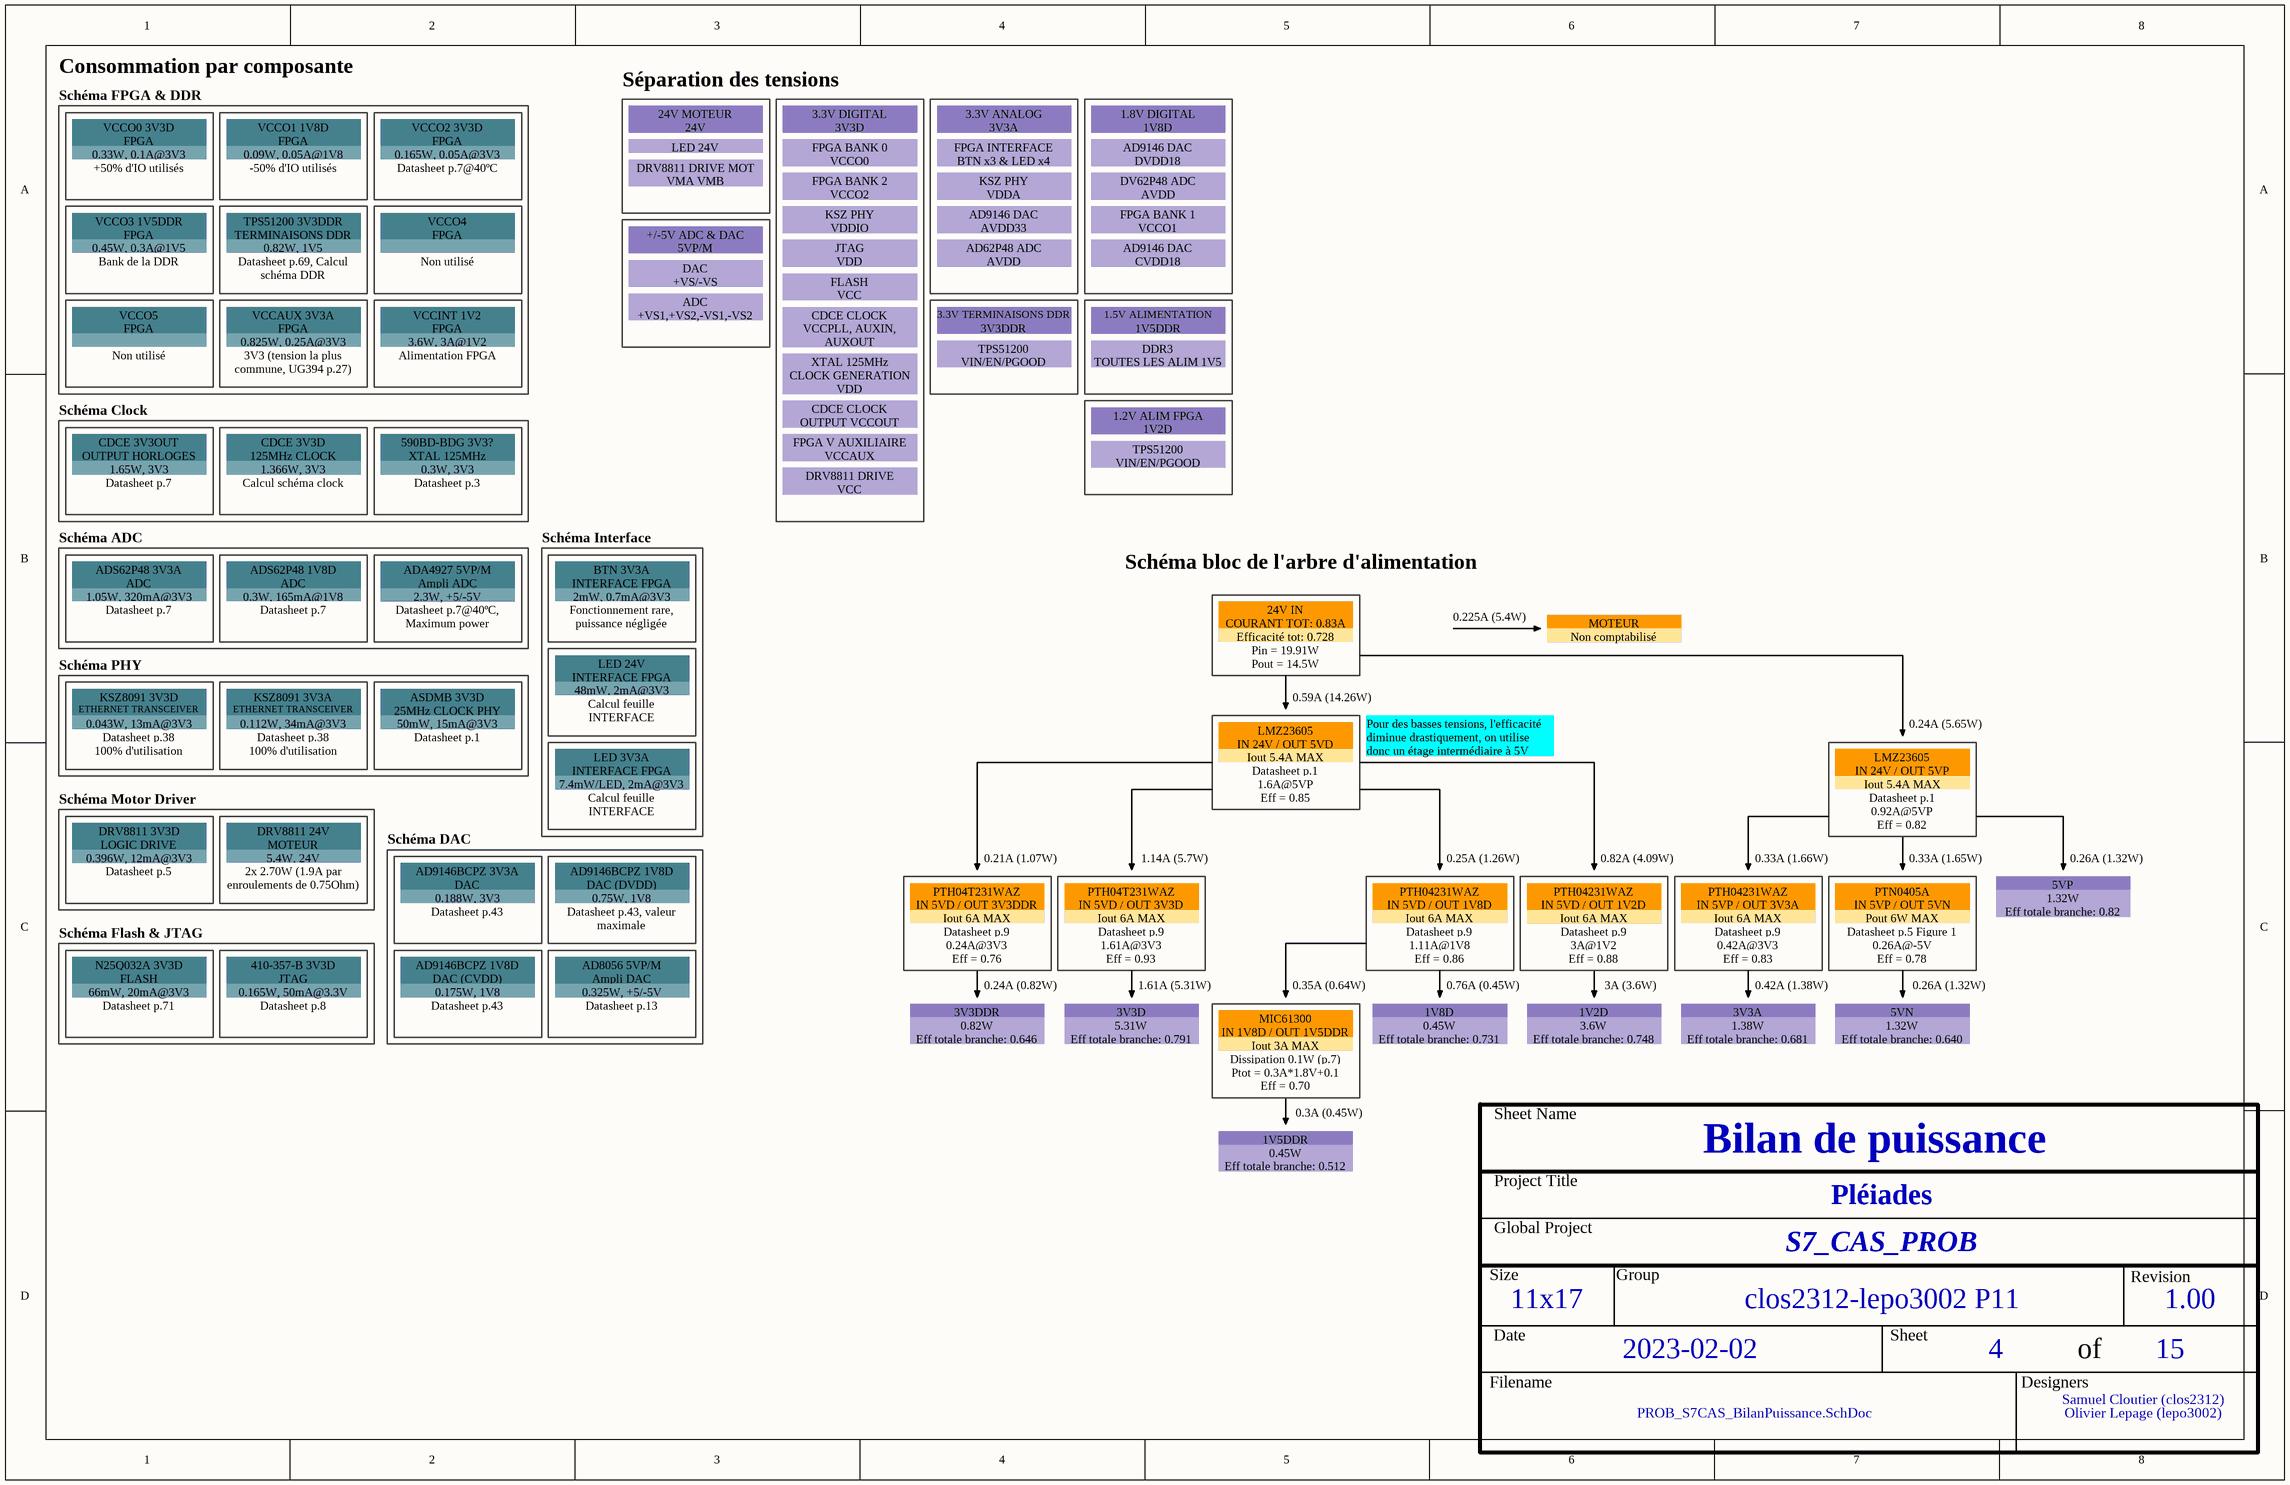
[diagram p3: PROB_S7CAS_BilanPuissance.SchDoc]

### Notes on the sheet
- Consommation par composante
- Séparation des tensions
- Schéma FPGA & DDR
- VCCO0 3V3D
- FPGA
- 0.33W, 0.1A@3V3
- VCCO1 1V8D
- 0.09W, 0.05A@1V8
- VCCO2 3V3D
- 0.165W, 0.05A@3V3
- 24V MOTEUR
- 24V
- LED 24V
- DRV8811 DRIVE MOT
- 3.3V DIGITAL
- 3V3D
- FPGA BANK 0
- VCCO0
- 3.3V ANALOG
- 3V3A
- FPGA INTERFACE
- BTN x3 & LED x4
- 1.8V DIGITAL
- 1V8D
- AD9146 DAC
- DVDD18
- +50% d'IO utilisés
- VCCO3 1V5DDR
- -50% d'IO utilisés
- TPS51200 3V3DDR
- Datasheet p.7@40ºC
- VCCO4
- VMA VMB
- Ptot: 5.47W
- FPGA BANK 2
- VCCO2
- KSZ PHY
- VDDIO
- VDDA
- AVDD33
- DV62P48 ADC
- AVDD
- FPGA BANK 1
- VCCO1
- 0.45W, 0.3A@1V5
- Bank de la DDR
- TERMINAISONS DDR
- 0.82W, 1V5
- Datasheet p.69, Calcul schéma DDR
- Non utilisé
- +/-5V ADC & DAC
- 5VP/M
- DAC
- +VS/-VS
- ADC
- JTAG
- VDD
- FLASH
- VCC
- AD62P48 ADC
- Ptot: 1.38W
- CVDD18
- Ptot: 0.45W
- VCCO5
- VCCAUX 3V3A
- 0.825W, 0.25A@3V3
- VCCINT 1V2
- 3.6W, 3A@1V2
- +VS1,+VS2,-VS1,-VS2
- Ptot: 2.63W
- XTAL 125MHz
- CDCE CLOCK
- VCCPLL, AUXIN, AUXOUT
- 3.3V TERMINAISONS DDR
- 3V3DDR
- TPS51200
- VIN/EN/PGOOD
- 1.5V ALIMENTATION DDR
- 1V5DDR
- DDR3
- TOUTES LES ALIM 1V5
- Schéma Clock
- 3V3 (tension la plus commune, UG394 p.27)
- Alimentation FPGA
- CLOCK GENERATION VDD
- OUTPUT VCCOUT
- Ptot: 0.82W
- 1.2V ALIM FPGA
- 1V2D
- CDCE 3V3OUT
- OUTPUT HORLOGES
- 1.65W, 3V3
- CDCE 3V3D
- 125MHz CLOCK
- 1.366W, 3V3
- 590BD-BDG 3V3?
- 0.3W, 3V3
- FPGA V AUXILIAIRE
- VCCAUX
- DRV8811 DRIVE
- Ptot: 3.60W
- Schéma ADC
- ADS62P48 3V3A
- Datasheet p.7
- ADS62P48 1V8D
- Calcul schéma clock
- ADA4927 5VP/M
- Datasheet p.3
- Schéma Interface
- BTN 3V3A
- Ptot: 5.31W
- Schéma bloc de l'arbre d'alimentation
- 1.05W, 320mA@3V3
- 0.3W, 165mA@1V8
- Ampli ADC
- Datasheet p.7@40ºC, Maximum power
- 2.3W, +5/-5V
- INTERFACE FPGA
- 2mW, 0.7mA@3V3
- Fonctionnement rare, puissance négligée
- 24V IN
- COURANT TOT: 0.83A
- 0.225A (5.4W)
- MOTEUR
- Schéma PHY
- KSZ8091 3V3D
- KSZ8091 3V3A
- ASDMB 3V3D
- 48mW, 2mA@3V3
- Efficacité tot: 0.728
- Pin = 19.91W
- Pout = 14.5W
- 0.59A (14.26W)
- Non comptabilisé
- ETHERNET TRANSCEIVER
- Datasheet p.38
- 0.043W, 13mA@3V3
- 100% d'utilisation
- 0.112W, 34mA@3V3
- 25MHz CLOCK PHY
- Datasheet p.1
- 50mW, 15mA@3V3
- Calcul feuille INTERFACE
- LED 3V3A
- LMZ23605
- IN 24V / OUT 5VD
- Iout 5.4A MAX
- Pour des basses tensions, l'efficacité diminue drastiquement, on utilise donc un étage intermédiaire à 5V
- 0.24A (5.65W)
- Schéma Motor Driver
- DRV8811 3V3D
- DRV8811 24V
- 7.4mW/LED, 2mA@3V3
- 1.6A@5VP
- Eff = 0.85
- 0.92A@5VP
- Eff = 0.82
- IN 24V / OUT 5VP
- LOGIC DRIVE
- Datasheet p.5
- 0.396W, 12mA@3V3
- 5.4W, 24V
- 2x 2.70W (1.9A par enroulements de 0.75Ohm)
- Schéma DAC
- AD9146BCPZ 3V3A
- 0.188W, 3V3
- AD9146BCPZ 1V8D
- DAC (DVDD)
- 0.75W, 1V8
- PTH04T231WAZ
- 0.21A (1.07W)
- 1.14A (5.7W)
- PTH04231WAZ
- 0.25A (1.26W)
- 0.82A (4.09W)
- 0.33A (1.66W)
- PTN0405A
- 0.33A (1.65W)
- 5VP
- 1.32W
- 0.26A (1.32W)
- Schéma Flash & JTAG
- N25Q032A 3V3D
- 410-357-B 3V3D
- Datasheet p.43
- Datasheet p.43, valeur maximale
- AD8056 5VP/M
- IN 5VD / OUT 3V3DDR
- Iout 6A MAX
- Datasheet p.9
- 0.24A@3V3
- Eff = 0.76
- IN 5VD / OUT 3V3D
- 1.61A@3V3
- Eff = 0.93
- IN 5VD / OUT 1V8D
- 1.11A@1V8
- Eff = 0.86
- 3A@1V2
- Eff = 0.88
- IN 5VD / OUT 1V2D
- IN 5VP / OUT 3V3A
- 0.42A@3V3
- Eff = 0.83
- IN 5VP / OUT 5VN
- Pout 6W MAX
- Datasheet p.5 Figure 1
- 0.26A@-5V
- Eff = 0.78
- Eff totale branche: 0.82
- Datasheet p.71
- 66mW, 20mA@3V3
- Datasheet p.8
- 0.165W, 50mA@3.3V
- DAC (CVDD)
- 0.175W, 1V8
- Ampli DAC
- Datasheet p.13
- 0.325W, +5/-5V
- 0.82W
- 0.24A (0.82W)
- 5.31W
- 1.61A (5.31W)
- MIC61300
- IN 1V8D / OUT 1V5DDR
- 0.35A (0.64W)
- 0.45W
- 0.76A (0.45W)
- 3.6W
- 3A (3.6W)
- 1.38W
- 0.42A (1.38W)
- 5VN
- Eff totale branche: 0.646
- Eff totale branche: 0.791
- Iout 3A MAX
- Dissipation 0.1W (p.7)
- Ptot = 0.3A*1.8V+0.1
- Eff = 0.70
- Eff totale branche: 0.731
- Eff totale branche: 0.748
- Eff totale branche: 0.681
- Eff totale branche: 0.640
- Eff totale branche: 0.512
- 0.3A (0.45W)
- Sheet Name
- Project Title
- Global Project
- Size
- Group
- Revision
- Date
- Sheet
- of
- Filename
- Designers

## Sheet PROB_S7CAS_FPGA_1.SchDoc
size Tabloid; SheetNumber: 5; SheetTotal: 15; Sheet_Name: Bank FPGA (1/3); Size: 11x17
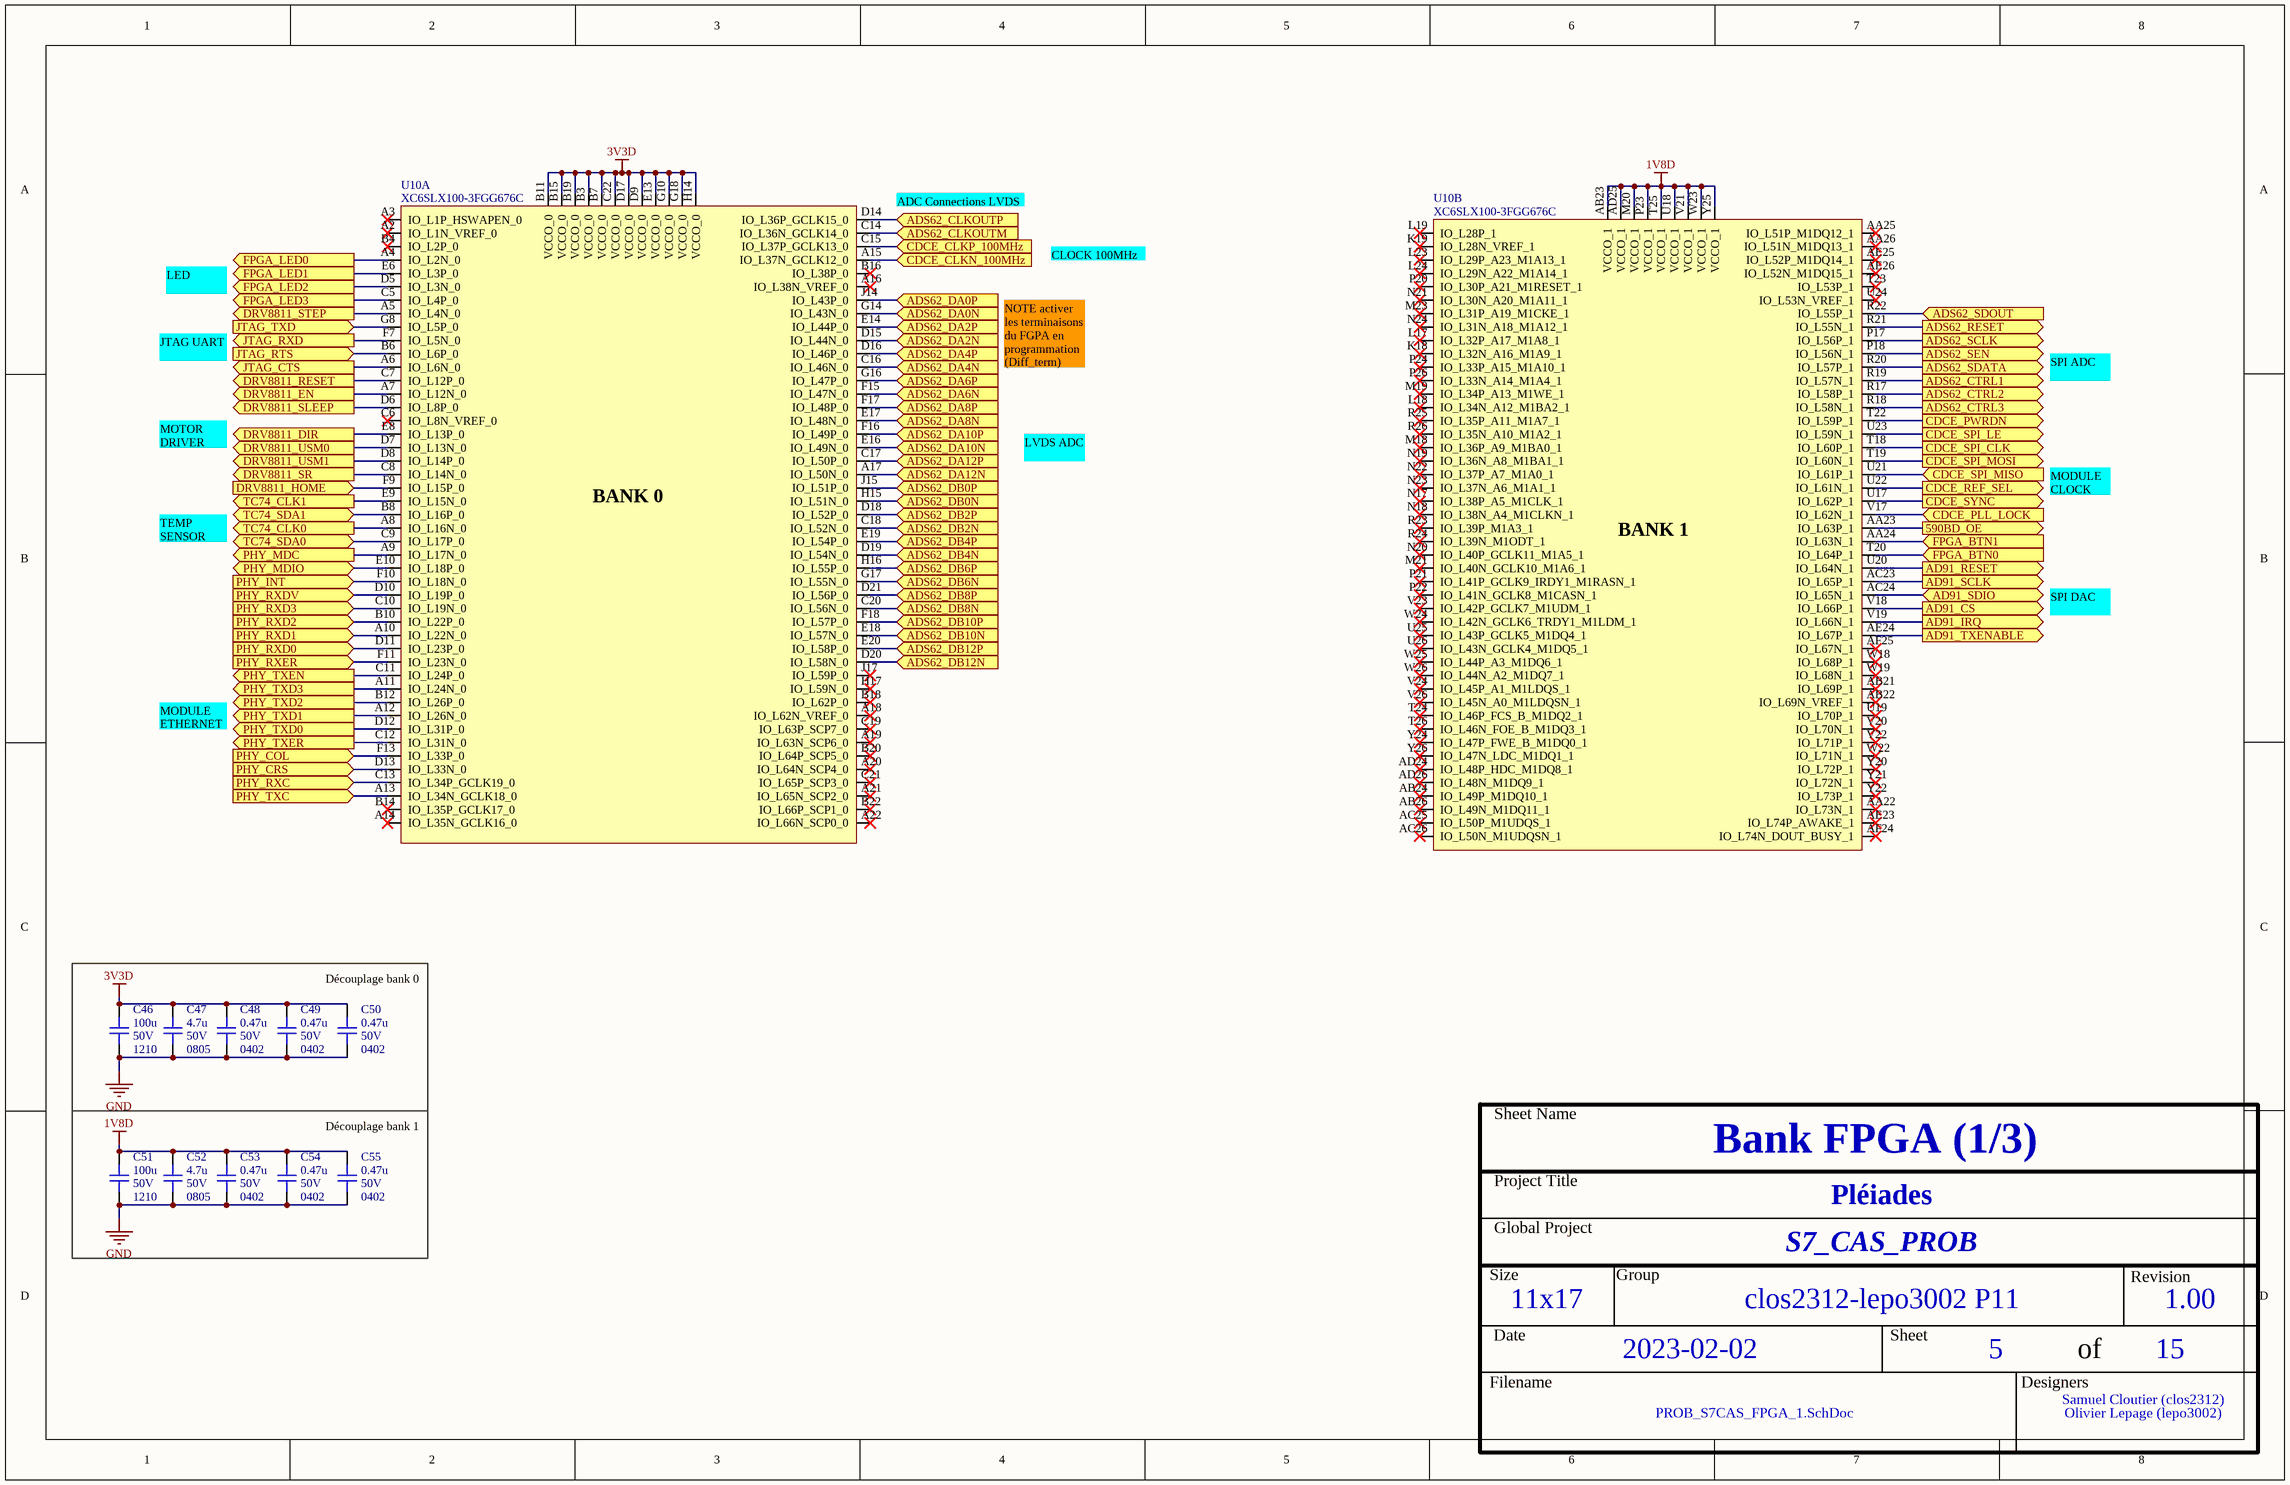
[diagram p4: PROB_S7CAS_FPGA_1.SchDoc]

### Parts
C46  value 100u  Voltage: 50V  Package: 1210  [CAP_1210]  (hidden comment: CAP - 1210)
C47  value 4.7u  Voltage: 50V  Package: 0805  [CAP_0805]  (hidden comment: CAP - 0805)
C48  value 0.47u  Voltage: 50V  Package: 0402  [CAP_0402]  (hidden comment: CAP - 0402)
C49  value 0.47u  Voltage: 50V  Package: 0402  [CAP_0402]  (hidden comment: CAP - 0402)
C50  value 0.47u  Voltage: 50V  Package: 0402  [CAP_0402]  (hidden comment: CAP - 0402)
C51  value 100u  Voltage: 50V  Package: 1210  [CAP_1210]  (hidden comment: CAP - 1210)
C52  value 4.7u  Voltage: 50V  Package: 0805  [CAP_0805]  (hidden comment: CAP - 0805)
C53  value 0.47u  Voltage: 50V  Package: 0402  [CAP_0402]  (hidden comment: CAP - 0402)
C54  value 0.47u  Voltage: 50V  Package: 0402  [CAP_0402]  (hidden comment: CAP - 0402)
C55  value 0.47u  Voltage: 50V  Package: 0402  [CAP_0402]  (hidden comment: CAP - 0402)
U10  XC6SLX100-3FGG676C  [FPGA_XILINX_FGG676]  (parts A,B of 10)

### Ports
590BD_OE (out), AD91_CS (out), AD91_IRQ (out), AD91_RESET (out), AD91_SCLK (out), AD91_SDIO (bidir), AD91_TXENABLE (out), ADS62_CLKOUTM (in), ADS62_CLKOUTP (in), ADS62_CTRL1 (out), ADS62_CTRL2 (out), ADS62_CTRL3 (out), ADS62_DA0N (in), ADS62_DA0P (in), ADS62_DA2N (in), ADS62_DA2P (in), ADS62_DA4N (in), ADS62_DA4P (in), ADS62_DA6N (in), ADS62_DA6P (in), ADS62_DA8N (in), ADS62_DA8P (in), ADS62_DA10N (in), ADS62_DA10P (in), ADS62_DA12N (in), ADS62_DA12P (in), ADS62_DB0N (in), ADS62_DB0P (in), ADS62_DB2N (in), ADS62_DB2P (in), ADS62_DB4N (in), ADS62_DB4P (in), ADS62_DB6N (in), ADS62_DB6P (in), ADS62_DB8N (in), ADS62_DB8P (in), ADS62_DB10N (in), ADS62_DB10P (in), ADS62_DB12N (in), ADS62_DB12P (in), ADS62_RESET (out), ADS62_SCLK (out), ADS62_SDATA (out), ADS62_SDOUT (in), ADS62_SEN (out), CDCE_CLKN_100MHz (in), CDCE_CLKP_100MHz (in), CDCE_PLL_LOCK (in), CDCE_PWRDN (out), CDCE_REF_SEL (out), CDCE_SPI_CLK (out), CDCE_SPI_LE (out), CDCE_SPI_MISO (in), CDCE_SPI_MOSI (out), CDCE_SYNC (out), DRV8811_DIR (out), DRV8811_EN (out), DRV8811_HOME (in), DRV8811_RESET (out), DRV8811_SLEEP (out), DRV8811_SR (out), DRV8811_STEP (out), DRV8811_USM0 (out), DRV8811_USM1 (out), FPGA_BTN0 (in), FPGA_BTN1 (in), FPGA_LED0 (out), FPGA_LED1 (out), FPGA_LED2 (out), FPGA_LED3 (out), JTAG_CTS (out), JTAG_RTS (in), JTAG_RXD (out), JTAG_TXD (in), PHY_COL (in), PHY_CRS (in), PHY_INT (in), PHY_MDC (out), PHY_MDIO (bidir), PHY_RXC (in), PHY_RXD0 (in), PHY_RXD1 (in), PHY_RXD2 (in), PHY_RXD3 (in), PHY_RXDV (in), PHY_RXER (in), PHY_TXC (in), PHY_TXD0 (out), PHY_TXD1 (out), PHY_TXD2 (out), PHY_TXD3 (out), PHY_TXEN (out), PHY_TXER (out), TC74_CLK0 (out), TC74_CLK1 (out), TC74_SDA0 (bidir), TC74_SDA1 (bidir)

### Nets
1V8D: C51.2 C52.2 C53.2 C54.2 C55.2 U10.AB23(VCCO_1) U10.AD25(VCCO_1) U10.M20(VCCO_1) U10.P23(VCCO_1) U10.T25(VCCO_1) U10.U18(VCCO_1) U10.V21(VCCO_1) U10.W23(VCCO_1) U10.Y25(VCCO_1)
3V3D: C46.2 C47.2 C48.2 C49.2 C50.2 U10.B3(VCCO_0) U10.B7(VCCO_0) U10.B11(VCCO_0) U10.B15(VCCO_0) U10.B19(VCCO_0) U10.C22(VCCO_0) U10.D9(VCCO_0) U10.D17(VCCO_0) U10.E13(VCCO_0) U10.G10(VCCO_0) U10.G18(VCCO_0) U10.H14(VCCO_0)
GND: C46.1 C47.1 C48.1 C49.1 C50.1 C51.1 C52.1 C53.1 C54.1 C55.1
590BD_OE: U10.AA23(IO_L63P_1) ; port 590BD_OE
AD91_CS: U10.V18(IO_L66P_1) ; port AD91_CS
AD91_IRQ: U10.V19(IO_L66N_1) ; port AD91_IRQ
AD91_RESET: U10.U20(IO_L64N_1) ; port AD91_RESET
AD91_SCLK: U10.AC23(IO_L65P_1) ; port AD91_SCLK
AD91_SDIO: U10.AC24(IO_L65N_1) ; port AD91_SDIO
AD91_TXENABLE: U10.AE24(IO_L67P_1) ; port AD91_TXENABLE
ADS62_CLKOUTM: U10.C14(IO_L36N_GCLK14_0) ; port ADS62_CLKOUTM
ADS62_CLKOUTP: U10.D14(IO_L36P_GCLK15_0) ; port ADS62_CLKOUTP
ADS62_CTRL1: U10.R19(IO_L57N_1) ; port ADS62_CTRL1
ADS62_CTRL2: U10.R17(IO_L58P_1) ; port ADS62_CTRL2
ADS62_CTRL3: U10.R18(IO_L58N_1) ; port ADS62_CTRL3
ADS62_DA0N: U10.G14(IO_L43N_0) ; port ADS62_DA0N
ADS62_DA0P: U10.J14(IO_L43P_0) ; port ADS62_DA0P
ADS62_DA2N: U10.D15(IO_L44N_0) ; port ADS62_DA2N
ADS62_DA2P: U10.E14(IO_L44P_0) ; port ADS62_DA2P
ADS62_DA4N: U10.C16(IO_L46N_0) ; port ADS62_DA4N
ADS62_DA4P: U10.D16(IO_L46P_0) ; port ADS62_DA4P
ADS62_DA6N: U10.F15(IO_L47N_0) ; port ADS62_DA6N
ADS62_DA6P: U10.G16(IO_L47P_0) ; port ADS62_DA6P
ADS62_DA8N: U10.E17(IO_L48N_0) ; port ADS62_DA8N
ADS62_DA8P: U10.F17(IO_L48P_0) ; port ADS62_DA8P
ADS62_DA10N: U10.E16(IO_L49N_0) ; port ADS62_DA10N
ADS62_DA10P: U10.F16(IO_L49P_0) ; port ADS62_DA10P
ADS62_DA12N: U10.A17(IO_L50N_0) ; port ADS62_DA12N
ADS62_DA12P: U10.C17(IO_L50P_0) ; port ADS62_DA12P
ADS62_DB0N: U10.H15(IO_L51N_0) ; port ADS62_DB0N
ADS62_DB0P: U10.J15(IO_L51P_0) ; port ADS62_DB0P
ADS62_DB2N: U10.C18(IO_L52N_0) ; port ADS62_DB2N
ADS62_DB2P: U10.D18(IO_L52P_0) ; port ADS62_DB2P
ADS62_DB4N: U10.D19(IO_L54N_0) ; port ADS62_DB4N
ADS62_DB4P: U10.E19(IO_L54P_0) ; port ADS62_DB4P
ADS62_DB6N: U10.G17(IO_L55N_0) ; port ADS62_DB6N
ADS62_DB6P: U10.H16(IO_L55P_0) ; port ADS62_DB6P
ADS62_DB8N: U10.C20(IO_L56N_0) ; port ADS62_DB8N
ADS62_DB8P: U10.D21(IO_L56P_0) ; port ADS62_DB8P
ADS62_DB10N: U10.E18(IO_L57N_0) ; port ADS62_DB10N
ADS62_DB10P: U10.F18(IO_L57P_0) ; port ADS62_DB10P
ADS62_DB12N: U10.D20(IO_L58N_0) ; port ADS62_DB12N
ADS62_DB12P: U10.E20(IO_L58P_0) ; port ADS62_DB12P
ADS62_RESET: U10.R21(IO_L55N_1) ; port ADS62_RESET
ADS62_SCLK: U10.P17(IO_L56P_1) ; port ADS62_SCLK
ADS62_SDATA: U10.R20(IO_L57P_1) ; port ADS62_SDATA
ADS62_SDOUT: U10.R22(IO_L55P_1) ; port ADS62_SDOUT
ADS62_SEN: U10.P18(IO_L56N_1) ; port ADS62_SEN
CDCE_CLKN_100MHz: U10.A15(IO_L37N_GCLK12_0) ; port CDCE_CLKN_100MHz
CDCE_CLKP_100MHz: U10.C15(IO_L37P_GCLK13_0) ; port CDCE_CLKP_100MHz
CDCE_PLL_LOCK: U10.V17(IO_L62N_1) ; port CDCE_PLL_LOCK
CDCE_PWRDN: U10.T22(IO_L59P_1) ; port CDCE_PWRDN
CDCE_REF_SEL: U10.U22(IO_L61N_1) ; port CDCE_REF_SEL
CDCE_SPI_CLK: U10.T18(IO_L60P_1) ; port CDCE_SPI_CLK
CDCE_SPI_LE: U10.U23(IO_L59N_1) ; port CDCE_SPI_LE
CDCE_SPI_MISO: U10.U21(IO_L61P_1) ; port CDCE_SPI_MISO
CDCE_SPI_MOSI: U10.T19(IO_L60N_1) ; port CDCE_SPI_MOSI
CDCE_SYNC: U10.U17(IO_L62P_1) ; port CDCE_SYNC
DRV8811_DIR: U10.E8(IO_L13P_0) ; port DRV8811_DIR
DRV8811_EN: U10.A7(IO_L12N_0) ; port DRV8811_EN
DRV8811_HOME: U10.F9(IO_L15P_0) ; port DRV8811_HOME
DRV8811_RESET: U10.C7(IO_L12P_0) ; port DRV8811_RESET
DRV8811_SLEEP: U10.D6(IO_L8P_0) ; port DRV8811_SLEEP
DRV8811_SR: U10.C8(IO_L14N_0) ; port DRV8811_SR
DRV8811_STEP: U10.A5(IO_L4N_0) ; port DRV8811_STEP
DRV8811_USM0: U10.D7(IO_L13N_0) ; port DRV8811_USM0
DRV8811_USM1: U10.D8(IO_L14P_0) ; port DRV8811_USM1
FPGA_BTN0: U10.T20(IO_L64P_1) ; port FPGA_BTN0
FPGA_BTN1: U10.AA24(IO_L63N_1) ; port FPGA_BTN1
FPGA_LED0: U10.A4(IO_L2N_0) ; port FPGA_LED0
FPGA_LED1: U10.E6(IO_L3P_0) ; port FPGA_LED1
FPGA_LED2: U10.D5(IO_L3N_0) ; port FPGA_LED2
FPGA_LED3: U10.C5(IO_L4P_0) ; port FPGA_LED3
JTAG_CTS: U10.A6(IO_L6N_0) ; port JTAG_CTS
JTAG_RTS: U10.B6(IO_L6P_0) ; port JTAG_RTS
JTAG_RXD: U10.F7(IO_L5N_0) ; port JTAG_RXD
JTAG_TXD: U10.G8(IO_L5P_0) ; port JTAG_TXD
PHY_COL: U10.F13(IO_L33P_0) ; port PHY_COL
PHY_CRS: U10.D13(IO_L33N_0) ; port PHY_CRS
PHY_INT: U10.F10(IO_L18N_0) ; port PHY_INT
PHY_MDC: U10.A9(IO_L17N_0) ; port PHY_MDC
PHY_MDIO: U10.E10(IO_L18P_0) ; port PHY_MDIO
PHY_RXC: U10.C13(IO_L34P_GCLK19_0) ; port PHY_RXC
PHY_RXD0: U10.D11(IO_L23P_0) ; port PHY_RXD0
PHY_RXD1: U10.A10(IO_L22N_0) ; port PHY_RXD1
PHY_RXD2: U10.B10(IO_L22P_0) ; port PHY_RXD2
PHY_RXD3: U10.C10(IO_L19N_0) ; port PHY_RXD3
PHY_RXDV: U10.D10(IO_L19P_0) ; port PHY_RXDV
PHY_RXER: U10.F11(IO_L23N_0) ; port PHY_RXER
PHY_TXC: U10.A13(IO_L34N_GCLK18_0) ; port PHY_TXC
PHY_TXD0: U10.D12(IO_L31P_0) ; port PHY_TXD0
PHY_TXD1: U10.A12(IO_L26N_0) ; port PHY_TXD1
PHY_TXD2: U10.B12(IO_L26P_0) ; port PHY_TXD2
PHY_TXD3: U10.A11(IO_L24N_0) ; port PHY_TXD3
PHY_TXEN: U10.C11(IO_L24P_0) ; port PHY_TXEN
PHY_TXER: U10.C12(IO_L31N_0) ; port PHY_TXER
TC74_CLK0: U10.A8(IO_L16N_0) ; port TC74_CLK0
TC74_CLK1: U10.E9(IO_L15N_0) ; port TC74_CLK1
TC74_SDA0: U10.C9(IO_L17P_0) ; port TC74_SDA0
TC74_SDA1: U10.B8(IO_L16P_0) ; port TC74_SDA1

Not connected (* = marked no-connect by the designer): U10 A2(IO_L1N_VREF_0)* A3(IO_L1P_HSWAPEN_0)* A14(IO_L35N_GCLK16_0)* A16(IO_L38N_VREF_0)* A18(IO_L62N_VREF_0)* A19(IO_L63N_SCP6_0)* A20(IO_L64N_SCP4_0)* A21(IO_L65N_SCP2_0)* A22(IO_L66N_SCP0_0)* AA22(IO_L73N_1)* AA25(IO_L51P_M1DQ12_1)* AA26(IO_L51N_M1DQ13_1)* AB21(IO_L69P_1)* AB22(IO_L69N_VREF_1)* AB24(IO_L49P_M1DQ10_1)* AB26(IO_L49N_M1DQ11_1)* AC25(IO_L50P_M1UDQS_1)* AC26(IO_L50N_M1UDQSN_1)* AD24(IO_L48P_HDC_M1DQ8_1)* AD26(IO_L48N_M1DQ9_1)* AE23(IO_L74P_AWAKE_1)* AE25(IO_L52P_M1DQ14_1)* AE26(IO_L52N_M1DQ15_1)* AF24(IO_L74N_DOUT_BUSY_1)* AF25(IO_L67N_1)* B4(IO_L2P_0)* B14(IO_L35P_GCLK17_0)* B16(IO_L38P_0)* B18(IO_L62P_0)* B20(IO_L64P_SCP5_0)* B22(IO_L66P_SCP1_0)* C6(IO_L8N_VREF_0)* C19(IO_L63P_SCP7_0)* C21(IO_L65P_SCP3_0)* H17(IO_L59N_0)* J17(IO_L59P_0)* K18(IO_L32N_A16_M1A9_1)* K19(IO_L28N_VREF_1)* L17(IO_L32P_A17_M1A8_1)* L18(IO_L34N_A12_M1BA2_1)* L19(IO_L28P_1)* L23(IO_L29P_A23_M1A13_1)* L24(IO_L29N_A22_M1A14_1)* M18(IO_L36P_A9_M1BA0_1)* M19(IO_L34P_A13_M1WE_1)* M21(IO_L40N_GCLK10_M1A6_1)* M23(IO_L31P_A19_M1CKE_1)* N17(IO_L38P_A5_M1CLK_1)* N18(IO_L38N_A4_M1CLKN_1)* N19(IO_L36N_A8_M1BA1_1)* N20(IO_L40P_GCLK11_M1A5_1)* N21(IO_L30N_A20_M1A11_1)* N22(IO_L37P_A7_M1A0_1)* N23(IO_L37N_A6_M1A1_1)* N24(IO_L31N_A18_M1A12_1)* P20(IO_L30P_A21_M1RESET_1)* P21(IO_L41P_GCLK9_IRDY1_M1RASN_1)* P22(IO_L41N_GCLK8_M1CASN_1)* P24(IO_L33P_A15_M1A10_1)* P26(IO_L33N_A14_M1A4_1)* R23(IO_L39P_M1A3_1)* R24(IO_L39N_M1ODT_1)* R25(IO_L35P_A11_M1A7_1)* R26(IO_L35N_A10_M1A2_1)* T23(IO_L53P_1)* T24(IO_L46P_FCS_B_M1DQ2_1)* T26(IO_L46N_FOE_B_M1DQ3_1)* U19(IO_L70P_1)* U24(IO_L53N_VREF_1)* U25(IO_L43P_GCLK5_M1DQ4_1)* U26(IO_L43N_GCLK4_M1DQ5_1)* V20(IO_L70N_1)* V22(IO_L71P_1)* V23(IO_L42P_GCLK7_M1UDM_1)* V24(IO_L45P_A1_M1LDQS_1)* V26(IO_L45N_A0_M1LDQSN_1)* W18(IO_L68P_1)* W19(IO_L68N_1)* W22(IO_L71N_1)* W24(IO_L42N_GCLK6_TRDY1_M1LDM_1)* W25(IO_L44P_A3_M1DQ6_1)* W26(IO_L44N_A2_M1DQ7_1)* Y20(IO_L72P_1)* Y21(IO_L72N_1)* Y22(IO_L73P_1)* Y24(IO_L47P_FWE_B_M1DQ0_1)* Y26(IO_L47N_LDC_M1DQ1_1)*

### Notes on the sheet
- (near U10) ADC Connections LVDS
- LED
- CLOCK 100MHz
- JTAG UART
- NOTE activer les terminaisons du FGPA en programmation (Diff_term)
- SPI ADC
- MOTOR DRIVER
- LVDS ADC
- MODULE CLOCK
- TEMP SENSOR
- SPI DAC
- MODULE ETHERNET
- Découplage bank 0
- Découplage bank 1
- Sheet Name
- Project Title
- Global Project
- Size
- Group
- Revision
- Date
- Sheet
- of
- Filename
- Designers
- (in symbol FPGA_XC6SLX100-3FGG676C, part A) BANK 0
- (in symbol FPGA_XC6SLX100-3FGG676C, part B) BANK 1

### Library data of the parts
C46 C51 = CAP - 1210: Precision: 10%; Current: *; CreatedBy: Jonathan Bouchard
C47 C52 = CAP - 0805: Precision: 10%; Current: *; CreatedBy: Jonathan Bouchard; Power: *
C48-C50 C53-C55 = CAP - 0402: Precision: 10%; Current: *; CreatedBy: Jonathan Bouchard; Power: *
U10 = FPGA_XC6SLX100-3FGG676C: FPGA - XILINX SPARTAN 6 480 I/O - BGA-676; Voltage: 1.14 V ~ 1.26 V; Current: *; Power: *; Mfg: Xilinx; Mfg Part Number: XC6SLX100-3FGG676C; HelpURL: https://www.xilinx.com/support/documentation/data_sheets/ds162.pdf; CreatedBy: Jonathan Bouchard; Temperature: 0°C ~ 85°C (TJ); Value: *; Precision: *; Package: BGA-676; Supplier 1: Digikey; Supplier Part Number 1: 122-1760-ND